# EAGLE design VSCard_v3.1 (EAGLE 8.3.1)
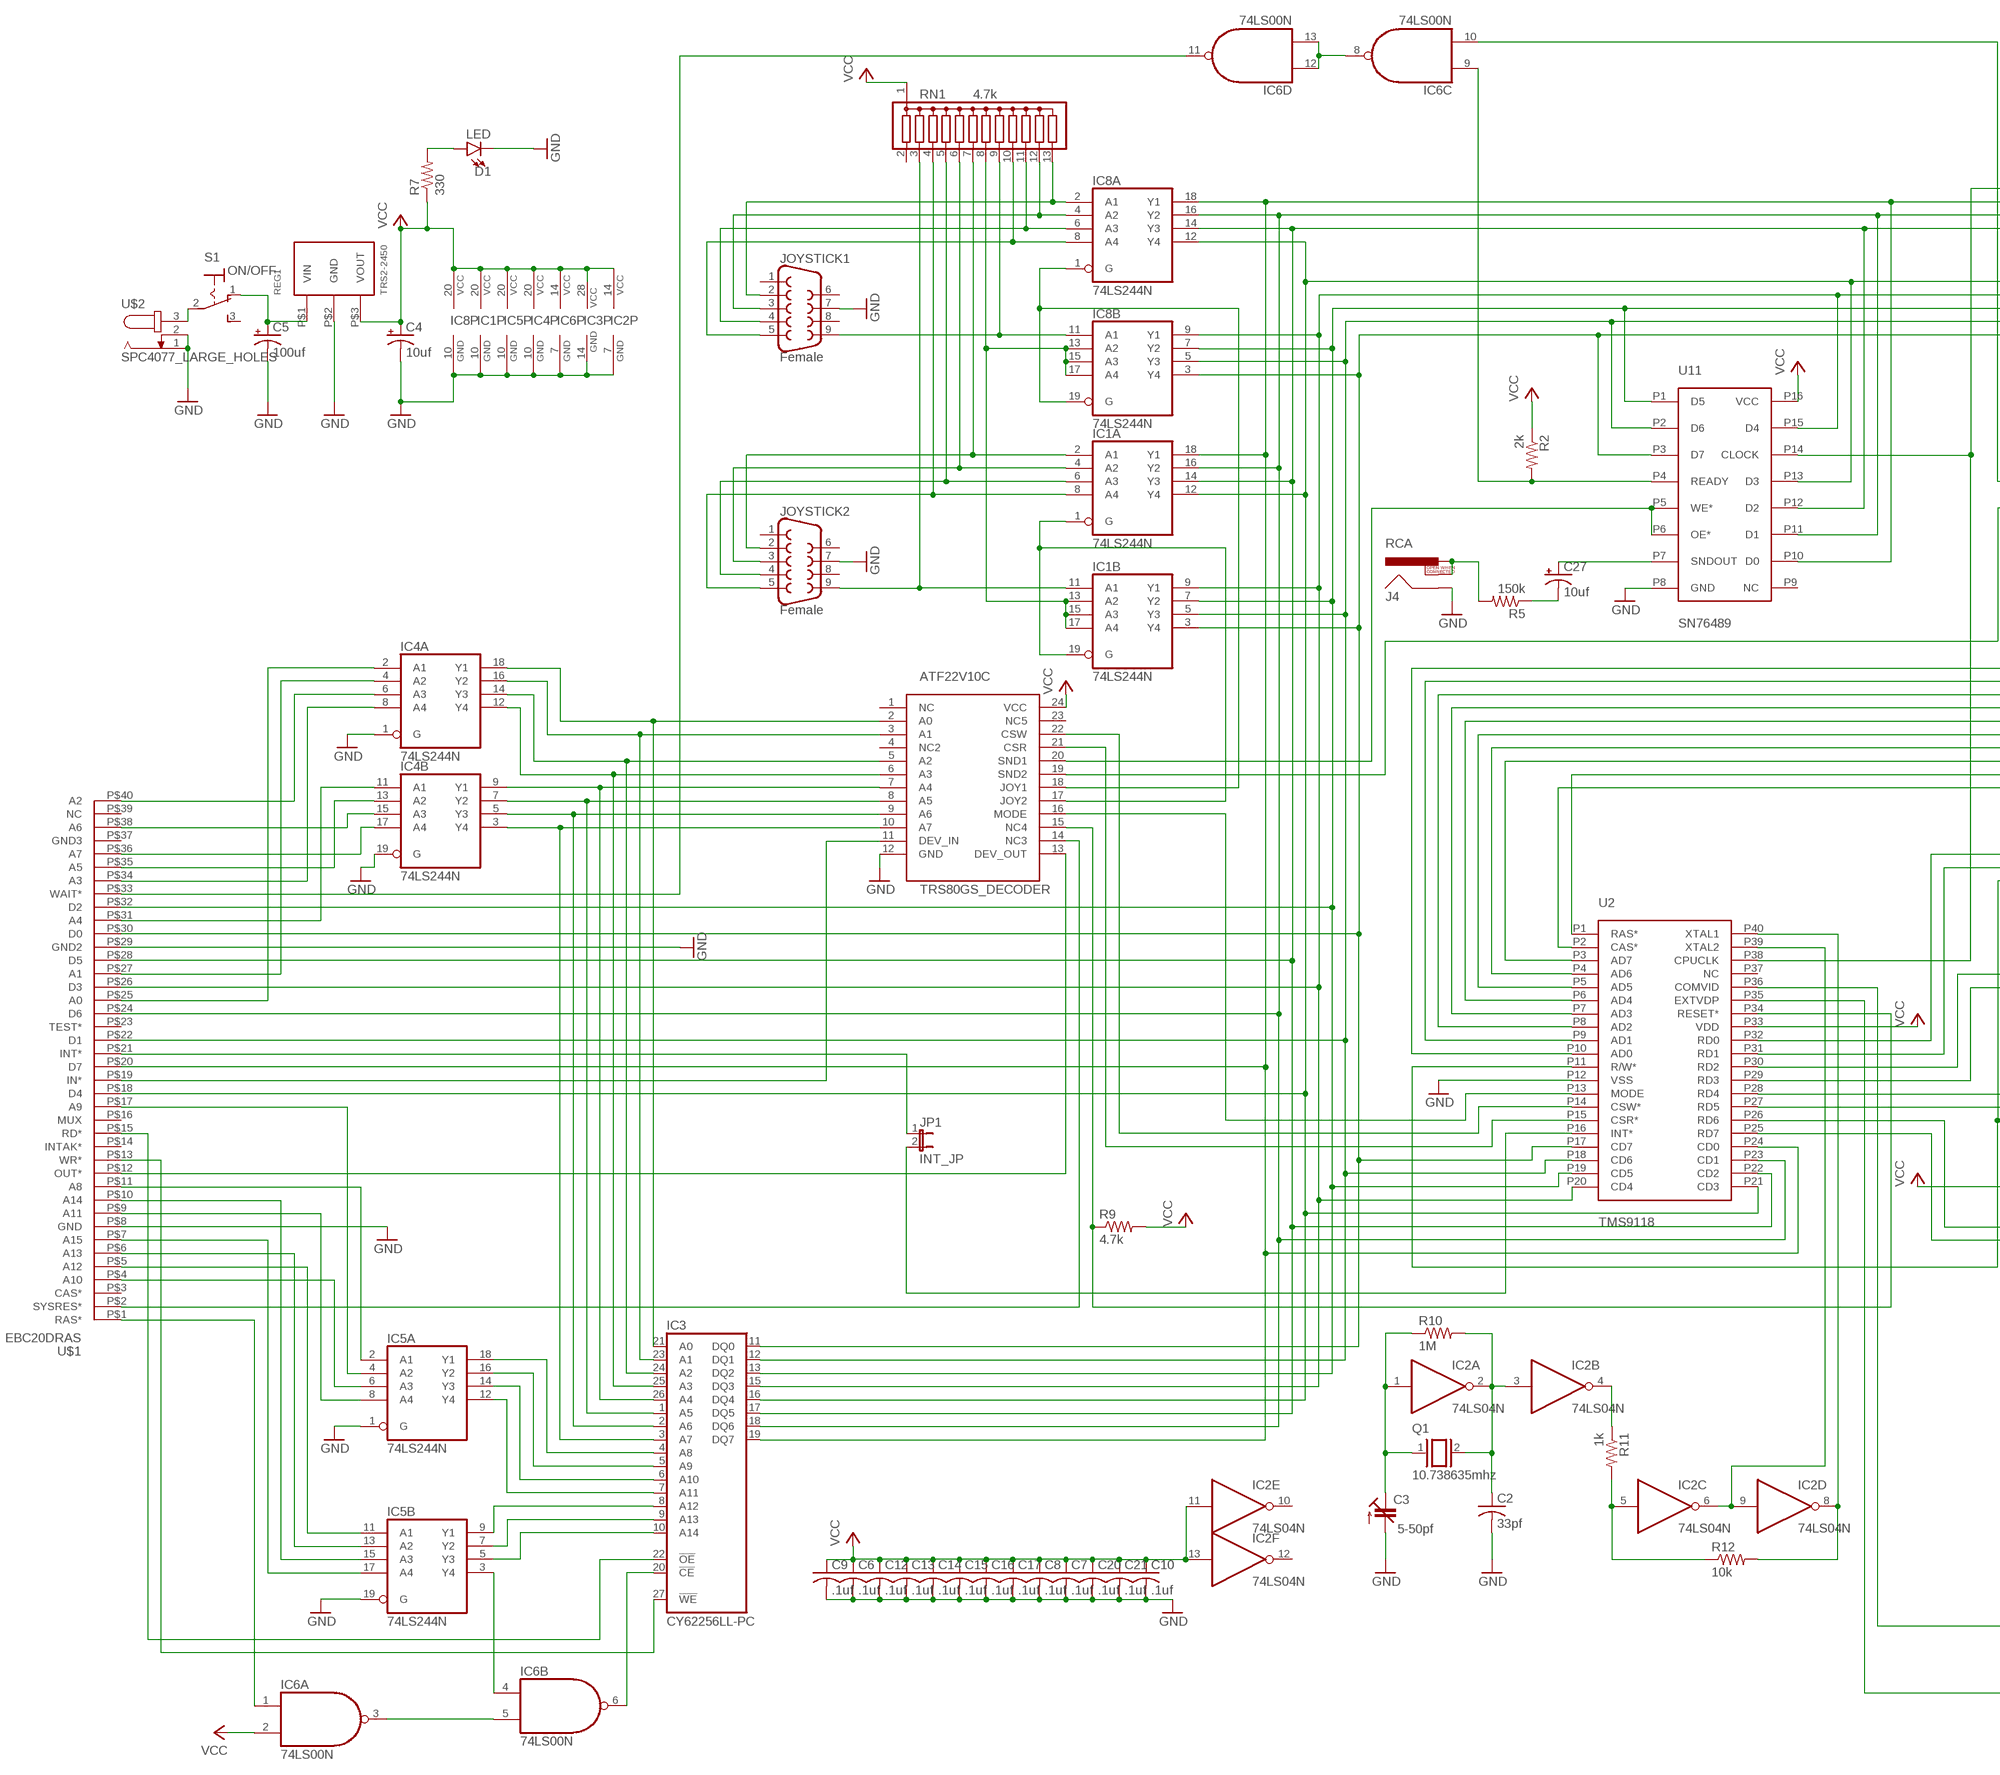
[diagram p0: schematic, sheet 1, part 1 of 2]
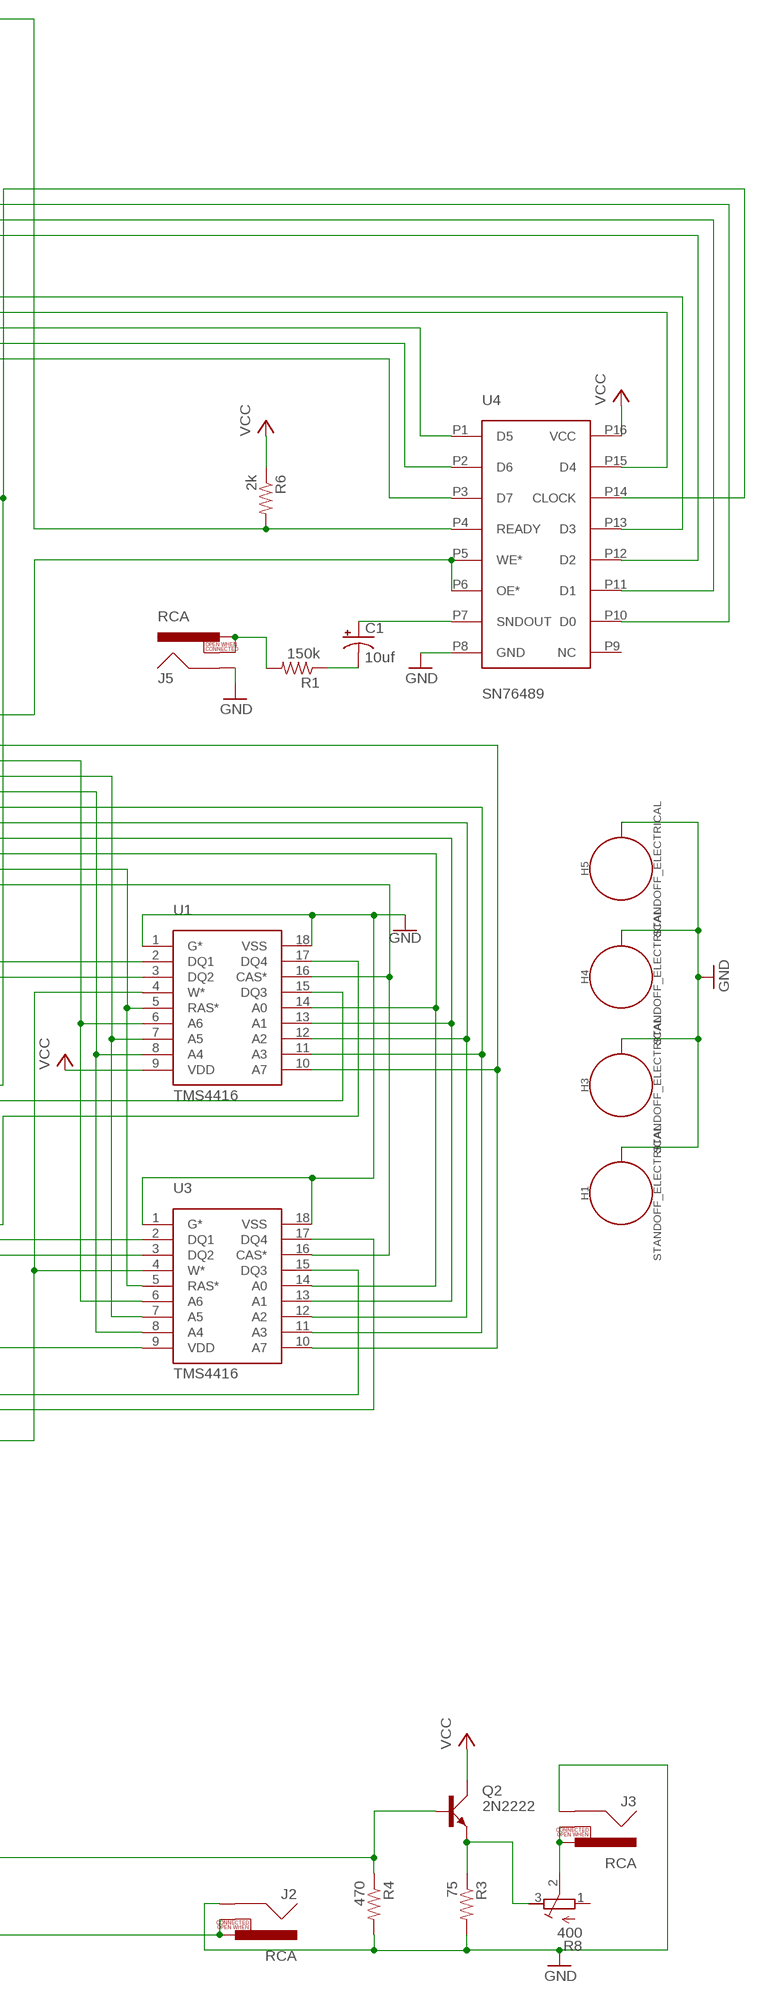
[diagram p1: schematic, sheet 1, part 2 of 2]

## Parts
ATF22V10C  TRS80GS_DECODER  [DIP24SKI]
C1  10uf  CPOL-USE2.5-6  [E2,5-6]
C2  33pf  C-US050-025X075  [C050-025X075]
C3  5-50pf  C-TRIMM3050.504  [CTRIM3050.504]
C4  10uf  CPOL-USE2.5-5  [E2,5-5]
C5  100uf  CPOL-USE3.5-10  [E3,5-10]
C6  .1uf  C-US025-025X050  [C025-025X050]
C7  .1uf  C-US025-025X050  [C025-025X050]
C8  .1uf  C-US025-025X050  [C025-025X050]
C9  .1uf  C-US025-025X050  [C025-025X050]
C10  .1uf  C-US025-025X050  [C025-025X050]
C12  .1uf  C-US025-025X050  [C025-025X050]
C13  .1uf  C-US025-025X050  [C025-025X050]
C14  .1uf  C-US025-025X050  [C025-025X050]
C15  .1uf  C-US025-025X050  [C025-025X050]
C16  .1uf  C-US025-025X050  [C025-025X050]
C17  .1uf  C-US025-025X050  [C025-025X050]
C20  .1uf  C-US025-025X050  [C025-025X050]
C21  .1uf  C-US025-025X050  [C025-025X050]
C27  10uf  CPOL-USE2.5-6  [E2,5-6]
D1  LED  LED3MM  [LED_3MM]
H1  STANDOFF_ELECTRICAL  [STANDOFF-ELECTRICAL]
H3  STANDOFF_ELECTRICAL  [STANDOFF-ELECTRICAL]
H4  STANDOFF_ELECTRICAL  [STANDOFF-ELECTRICAL]
H5  STANDOFF_ELECTRICAL  [STANDOFF-ELECTRICAL]
IC1  74LS244N  [DIL20]
IC2  74LS04N  [DIL14]
IC3  CY62256LL-PC  [DIL28-6]
IC4  74LS244N  [DIL20]
IC5  74LS244N  [DIL20]
IC6  74LS00N  [DIL14]
IC8  74LS244N  [DIL20]
J2  RCA  [RCA]
J3  RCA  [RCA]
J4  RCA  [RCA]
J5  RCA  [RCA]
JOYSTICK1  Female  DB9FEMALE  [DB9]
JOYSTICK2  Female  DB9FEMALE  [DB9]
JP1  INT_JP  JP1E  [JP1]
Q1  10.738635mhz  XTAL/S  [QS]
Q2  2N2222  [TO18A]
R1  150k  R-US_0207/2V  [0207/2V]
R2  2k  R-US_0207/2V  [0207/2V]
R3  75  R-US_0207/2V  [0207/2V]
R4  470  R-US_0207/2V  [0207/2V]
R5  150k  R-US_0207/2V  [0207/2V]
R6  2k  R-US_0207/2V  [0207/2V]
R7  330  R-US_0309/V  [0309V]
R8  400  R-TRIMM64W  [RTRIM64W]
R9  4.7k  R-US_0207/2V  [0207/2V]
R10  1M  R-US_0204/2V  [0204V]
R11  1k  R-US_0204/2V  [0204V]
R12  10k  R-US_0204/2V  [0204V]
REG1  TRS2-2450  [TRACON_REG]
RN1  4.7k  G12R  [SIL13]
S1  ON/OFF  320-916  [320-916]
U1  TMS4416  [DIP18]
U2  TMS9118  [DIP40_MCU]
U3  TMS4416  [DIP18]
U4  SN76489  [DIP16]
U11  SN76489  [DIP16]
U$1  EBC20DRAS  [EBC20DRAS]
U$2  SPC4077_LARGE_HOLES  [SPC4077]

## Nets
A0: IC4.2(A:A1) U$1.P$25(A0)
A1: IC4.4(A:A2) U$1.P$27(A1)
A2: IC4.6(A:A3) U$1.P$40(A2)
A3: IC4.8(A:A4) U$1.P$34(A3)
A4: IC4.11(B:A1) U$1.P$31(A4)
A5: IC4.13(B:A2) U$1.P$35(A5)
A6: IC4.15(B:A3) U$1.P$38(A6)
A7: ATF22V10C.10(A7) IC3.3(A7) IC4.3(B:Y4)
COMVID: Q2.B R4.1 U2.P36(COMVID)
COMVID-OUT: Q2.E R3.1 R8.3(E)
D0: IC1.3(B:Y4) IC3.11(DQ0) IC8.3(B:Y4) U2.P17(CD7) U4.P3(D7) U11.P3(D7) U$1.P$30(D0)
D1: IC1.5(B:Y3) IC3.12(DQ1) IC8.5(B:Y3) U2.P18(CD6) U4.P2(D6) U11.P2(D6) U$1.P$22(D1)
D2: IC1.7(B:Y2) IC3.13(DQ2) IC8.7(B:Y2) U2.P19(CD5) U4.P1(D5) U11.P1(D5) U$1.P$32(D2)
D3: IC1.9(B:Y1) IC3.15(DQ3) IC8.9(B:Y1) U2.P20(CD4) U4.P15(D4) U11.P15(D4) U$1.P$26(D3)
D4: IC1.12(A:Y4) IC3.16(DQ4) IC8.12(A:Y4) U2.P21(CD3) U4.P13(D3) U11.P13(D3) U$1.P$18(D4)
D5: IC1.14(A:Y3) IC3.17(DQ5) IC8.14(A:Y3) U2.P22(CD2) U4.P12(D2) U11.P12(D2) U$1.P$28(D5)
D6: IC1.16(A:Y2) IC3.18(DQ6) IC8.16(A:Y2) U2.P23(CD1) U4.P11(D1) U11.P11(D1) U$1.P$24(D6)
D7: IC1.18(A:Y1) IC3.19(DQ7) IC8.18(A:Y1) U2.P24(CD0) U4.P10(D0) U11.P10(D0) U$1.P$20(D7)
DOWN: IC8.4(A:A2) JOYSTICK1.3 RN1.12
DOWN1: IC1.4(A:A2) JOYSTICK2.3 RN1.6
GND: ATF22V10C.12(GND) C2.2 C3.2(A) C4.- C5.- C6.2 C7.2 C8.2 C9.2 C10.2 C12.2 C13.2 C14.2 C15.2 C16.2 C17.2 C20.2 C21.2 D1.K(C) H1.P1 H3.P1 H4.P1 H5.P1 IC1.10(P:GND) IC2.7(P:GND) IC3.14(GND) IC4.1(A:G) IC4.10(P:GND) IC4.19(B:G) IC5.1(A:G) IC5.10(P:GND) IC5.19(B:G) IC6.7(P:GND) IC8.10(P:GND) J2.SHELL J3.SHELL J4.SHELL J5.SHELL JOYSTICK1.7 JOYSTICK2.7 R3.2 R4.2 REG1.P$2(GND) U1.1(G*) U1.18(VSS) U2.P12(VSS) U3.1(G*) U3.18(VSS) U4.P8(GND) U11.P8(GND) U$1.P$8(GND) U$1.P$29(GND2) U$2.1 U$2.2
IN*: ATF22V10C.11(DEV_IN) U$1.P$19(IN*)
INT*: JP1.1 U$1.P$21(INT*)
JOY1_IN_ENABLE_N: ATF22V10C.18(JOY1) IC8.1(A:G) IC8.19(B:G)
JOY1_IN_ENABLE_N1: ATF22V10C.17(JOY2) IC1.1(A:G) IC1.19(B:G)
LEFT: IC8.6(A:A3) JOYSTICK1.4 RN1.11
LEFT1: IC1.6(A:A3) JOYSTICK2.4 RN1.5
N$1: J4.PIN J4.SWITCH R5.2
N$2: S1.2(P) U$2.3
N$3: JP1.2 U2.P16(INT*)
N$4: J3.PIN J3.SWITCH R8.2(S)
N$5: ATF22V10C.2(A0) IC3.21(A0) IC4.18(A:Y1)
N$6: ATF22V10C.7(A4) IC3.26(A4) IC4.9(B:Y1)
N$7: ATF22V10C.3(A1) IC3.23(A1) IC4.16(A:Y2)
N$8: ATF22V10C.5(A2) IC3.24(A2) IC4.14(A:Y3)
N$9: ATF22V10C.6(A3) IC3.25(A3) IC4.12(A:Y4)
N$10: ATF22V10C.8(A5) IC3.1(A5) IC4.7(B:Y2)
N$11: C3.1(E) IC2.1(A:I) Q1.1 R10.1
N$12: ATF22V10C.9(A6) IC3.2(A6) IC4.5(B:Y3)
N$13: IC5.2(A:A1) U$1.P$11(A8)
N$14: ATF22V10C.22(CSW) U2.P14(CSW*)
N$15: ATF22V10C.21(CSR) U2.P15(CSR*)
N$16: C2.1 IC2.2(A:O) IC2.3(B:I) Q1.2 R10.2
N$17: J2.PIN J2.SWITCH U2.P35(EXTVDP)
N$18: U1.5(RAS*) U2.P1(RAS*) U3.5(RAS*)
N$19: IC5.4(A:A2) U$1.P$17(A9)
N$20: D1.A R7.2
N$21: U1.16(CAS*) U2.P2(CAS*) U3.16(CAS*)
N$22: IC4.17(B:A4) U$1.P$36(A7)
N$23: IC5.6(A:A3) U$1.P$4(A10)
N$24: J5.PIN J5.SWITCH R1.2
N$25: IC5.8(A:A4) U$1.P$9(A11)
N$26: IC5.11(B:A1) U$1.P$5(A12)
N$27: IC5.13(B:A2) U$1.P$6(A13)
N$28: IC5.15(B:A3) U$1.P$10(A14)
N$29: IC5.17(B:A4) U$1.P$7(A15)
N$30: IC3.4(A8) IC5.18(A:Y1)
N$31: IC3.5(A9) IC5.16(A:Y2)
N$32: IC3.6(A10) IC5.14(A:Y3)
N$33: IC3.7(A11) IC5.12(A:Y4)
N$34: IC3.8(A12) IC5.9(B:Y1)
N$35: IC3.9(A13) IC5.7(B:Y2)
N$36: IC3.10(A14) IC5.5(B:Y3)
N$37: IC6.1(A:I0) U$1.P$1(RAS*)
N$38: IC5.3(B:Y4) IC6.4(B:I0)
N$39: IC6.3(A:O) IC6.5(B:I1)
N$40: IC3.20(!CE) IC6.6(B:O)
N$41: IC6.8(C:O) IC6.12(D:I0) IC6.13(D:I1)
N$42: IC3.27(!WE) U$1.P$13(WR*)
N$43: IC3.22(!OE) U$1.P$15(RD*)
N$44: IC2.4(B:O) R11.1
N$45: IC2.5(C:I) R11.2 R12.1
N$46: IC2.6(C:O) IC2.9(D:I) U2.P39(XTAL2)
N$47: IC2.8(D:O) R12.2 U2.P40(XTAL1)
N$64: C27.- R5.1
N$94: C1.- R1.1
N$99: IC1.13(B:A2) IC1.15(B:A3) IC1.17(B:A4) IC8.13(B:A2) IC8.15(B:A3) IC8.17(B:A4) RN1.8
OUT*: ATF22V10C.13(DEV_OUT) U$1.P$12(OUT*)
RIGHT: IC8.8(A:A4) JOYSTICK1.5 RN1.10
RIGHT1: IC1.8(A:A4) JOYSTICK2.5 RN1.4
SN76489-CLOCK: U2.P38(CPUCLK) U4.P14(CLOCK) U11.P14(CLOCK)
SND1_ENABLE_N: ATF22V10C.20(SND1) U11.P5(WE*) U11.P6(OE*)
SND1_READY: IC6.9(C:I0) R2.2 U11.P4(READY)
SND2_ENABLE_N: ATF22V10C.19(SND2) U4.P5(WE*) U4.P6(OE*)
SND2_READY: IC6.10(C:I1) R6.2 U4.P4(READY)
SNDOUT1: C27.+ U11.P7(SNDOUT)
SNDOUT2: C1.+ U4.P7(SNDOUT)
SYSRESET*: ATF22V10C.14(NC3) U$1.P$2(SYSRES*)
TMS9118_RW(*)_TMS4416_W(*): U1.4(W*) U2.P11(R/W*) U3.4(W*)
TMS9918_AD0-TMS4416_A7: U1.10(A7) U2.P10(AD0) U3.10(A7)
TMS9918_AD1-TMS4416_A6: U1.6(A6) U2.P9(AD1) U3.6(A6)
TMS9918_AD2-TMS4416_A5: U1.7(A5) U2.P8(AD2) U3.7(A5)
TMS9918_AD3-TMS4416_A4: U1.8(A4) U2.P7(AD3) U3.8(A4)
TMS9918_AD4-TMS4416_A3: U1.11(A3) U2.P6(AD4) U3.11(A3)
TMS9918_AD5-TMS4416_A2: U1.12(A2) U2.P5(AD5) U3.12(A2)
TMS9918_AD6-TMS4416_A1: U1.13(A1) U2.P4(AD6) U3.13(A1)
TMS9918_AD7-TMS4416_A0: U1.14(A0) U2.P3(AD7) U3.14(A0)
TRIGGER: IC8.11(B:A1) JOYSTICK1.9 RN1.9
TRIGGER1: IC1.11(B:A1) JOYSTICK2.9 RN1.3
UP: IC8.2(A:A1) JOYSTICK1.2 RN1.13
UP1: IC1.2(A:A1) JOYSTICK2.2 RN1.7
VCC: ATF22V10C.24(VCC) C4.+ C6.1 C7.1 C8.1 C9.1 C10.1 C12.1 C13.1 C14.1 C15.1 C16.1 C17.1 C20.1 C21.1 IC1.20(P:VCC) IC2.11(E:I) IC2.13(F:I) IC2.14(P:VCC) IC3.28(VCC) IC4.20(P:VCC) IC5.20(P:VCC) IC6.2(A:I1) IC6.14(P:VCC) IC8.20(P:VCC) Q2.C R2.1 R6.1 R7.1 R9.2 REG1.P$3(VOUT) RN1.1 U1.9(VDD) U2.P33(VDD) U3.9(VDD) U4.P16(VCC) U11.P16(VCC)
VDP-RD0: U1.2(DQ1) U2.P32(RD0)
VDP-RD1: U1.3(DQ2) U2.P31(RD1)
VDP-RD2: U1.15(DQ3) U2.P30(RD2)
VDP-RD3: U1.17(DQ4) U2.P29(RD3)
VDP-RD4: U2.P28(RD4) U3.2(DQ1)
VDP-RD5: U2.P27(RD5) U3.3(DQ2)
VDP-RD6: U2.P26(RD6) U3.15(DQ3)
VDP-RD7: U2.P25(RD7) U3.17(DQ4)
VDP_MODE: ATF22V10C.16(MODE) U2.P13(MODE)
VID_RESET*: ATF22V10C.15(NC4) R9.1 U2.P34(RESET*)
VOLTAGE-IN: C5.+ REG1.P$1(VIN) S1.1(O)
WAIT*: IC6.11(D:O) U$1.P$33(WAIT*)
Unconnected: ATF22V10C.1(NC) ATF22V10C.4(NC2) ATF22V10C.23(NC5) IC2.10(E:O) IC2.12(F:O) JOYSTICK1.1 JOYSTICK1.6 JOYSTICK1.8 JOYSTICK2.1 JOYSTICK2.6 JOYSTICK2.8 R8.1(A) RN1.2 S1.3(S) U2.P37(NC) U4.P9(NC) U11.P9(NC) U$1.P$3(CAS*) U$1.P$14(INTAK*) U$1.P$16(MUX) U$1.P$23(TEST*) U$1.P$37(GND3) U$1.P$39(NC)

## Library data of the parts
ATF22V10C = TMS99:TRS80GS_DECODER
C1 C4 C27 = resistor:CPOL-US: POLARIZED CAPACITOR, American symbol
C2 = rcl:C-US: CAPACITOR, American symbol
C3 = resistor:C-TRIMM: Trimm capacitor
C5 = rcl:CPOL-US: POLARIZED CAPACITOR, American symbol
C6-C10 C12-C17 C20 C21 = resistor:C-US: CAPACITOR, American symbol
D1 = SparkFun-LED:LED: LED (Generic) Standard schematic elements and footprints for 5mm, 3mm, 1206, and 0603 sized LEDs. Generic LEDs with no color specified.; PROD_ID: DIO-08794
H1 H3-H5 = SparkFun-Hardware:STANDOFF_ELECTRICAL: Stand Off Drill holes with an electrical connection. For example, use these to ground your board to a chassis. Example SparkFun Products Screw - Phillips Head (1/4", 4-40, 10 pack) <https://www.sparkfun.com/products/10453> (PRT-10453) Screw - Phillips Head (1/2", 4-40, 10 pack) <https://www.sparkfun.com/products/10452> (PRT-10452) Screw - Phillips Head (3/4", 4-40, 10 pack) <https://www.sparkfun.com/products/10451> (PRT-10451) Screw - Phillips Head (1", 4-40, 10 pack) <https://www.sparkfun.com/products/10450> (PRT-10450)
IC1 IC4 IC5 IC8 = 74xx-us:74*244: Octal BUFFER and LINE DRIVER, 3-state
IC2 = 74xx-us:74*04: Hex INVERTER
IC3 = memory-sram:CY62256LL-?*: 256K (32K x 8) CMOS-Static RAM Source: http://download.cypress.com.edgesuite.net/design_resources/datasheets/contents/cy62256_8.pdf
IC6 = 74xx-us:74*00: Quad 2-input NAND gate
J2-J5 = SparkFun-Connectors:RCA: RCA Jack connector This is a right angle RCA jack connecotr. Commonly used for video or audio. Here is the connector we sell at SparkFun: RCA Jack <https://www.sparkfun.com/products/8631> (PRT-08631) Datasheet <http://www.sparkfun.com/datasheets/Prototyping/Connectors/RCA-Jack.pdf> It is not used on any active designs, however it was used on a couple retired products: RCA Jack Breakout [RETIRED] <https://www.sparkfun.com/products/8826> (PRT-08826) SparkFun On Screen Display Breakout - MAX7456 [RETIRED] <https://www.sparkfun.com/products/9168> (BOB-09168) You may also be interested in a cable: RCA Video Cable - 6' <https://www.sparkfun.com/products/11573> (CAB-11573); PROD_ID: CONN-09081; SF_ID: PRT-08631
JOYSTICK1 JOYSTICK2 = SparkFun-Connectors:DB9: DB9 Connector Standard DB9 (D-Sub 9) serial connector. Can be used for CAN bus as well as RS485 and RS232. Footprint production proven. Here is the female version connector we sell at SparkFun: 9 Pin Female Serial Connector - PCB Mount <https://www.sparkfun.com/products/429> (PRT-00429) This connector has been used on the following SparkFun products: SparkFun RS232 Shifter - SMD <https://www.sparkfun.com/products/449> (PRT-00449) SparkFun RS232 Shifter SMD (No DB9) <https://www.sparkfun.com/products/8780> (PRT-08780); PROD_ID: CONN-08194
JP1 = jumper:JP1E: JUMPER
Q1 = special:XTAL/S: CRYSTAL
Q2 = transistor-small-signal:2N2222: NPN TRANSISTOR
R1-R7 R9 = resistor:R-US_: RESISTOR, American symbol
R8 = resistor:R-TRIMM: Trimm resistor
R10-R12 = rcl:R-US_: RESISTOR, American symbol
REG1 = TMS99:TRS2-2450: 5V TRACO regulator
RN1 = resistor-sil:G12R: SIL RESISTOR; OC_FARNELL: unknown; OC_NEWARK: unknown
S1 = switch:320-916: TOGGLE SWITCH distributor RS Components
U1 U3 = TMS99:TMS4416: TMS4416
U2 = TMS99:TMS9118: TMS9118
U4 U11 = TMS99:SN76489: SN76489 Sound Chip
U$1 = TMS99:EBC20DRAS
U$2 = con-jack:SPC4077_LARGE_HOLES

## Board
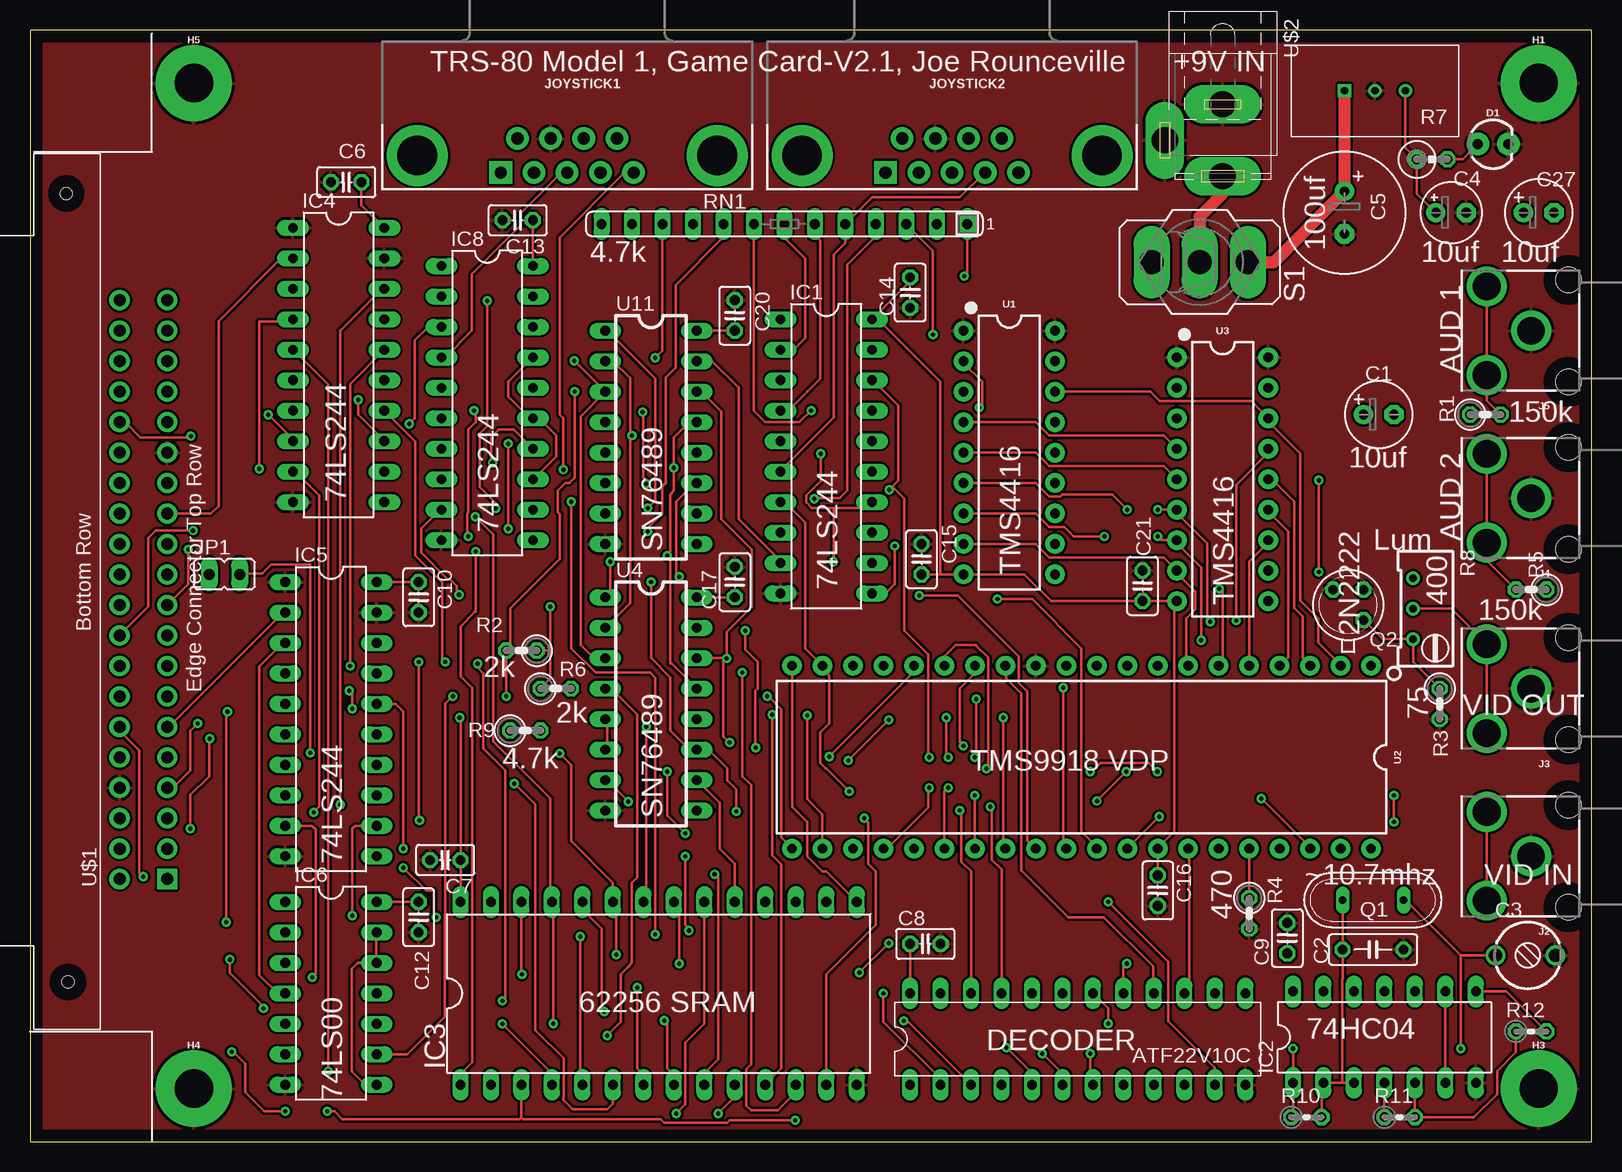
[diagram p2: board, top side]
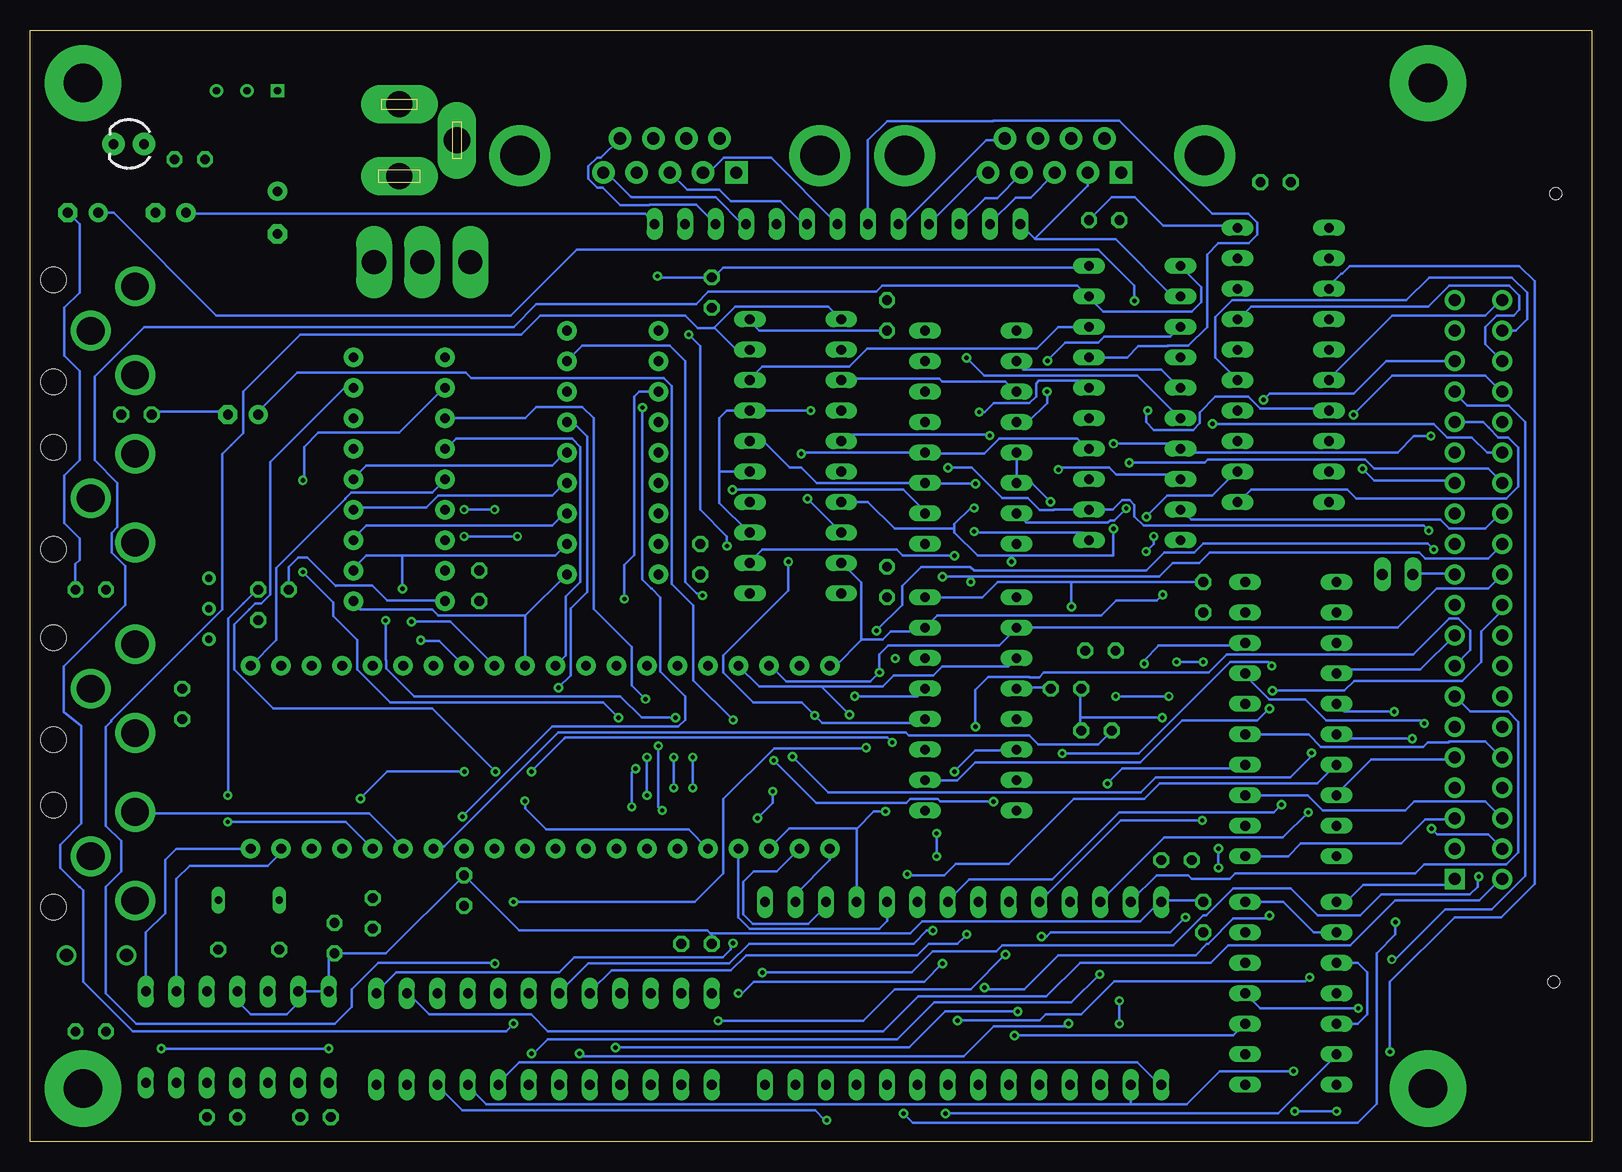
[diagram p3: board, bottom side, seen from below]

Size 130.16 x 92.7 mm. Coordinates in mm from the lower left corner, seen from the top.
Outline: 0,0 130.16,0 130.16,92.7 0,92.7 0,0
Copper layers (1*16): Top 0.035mm / dielectric 1.5mm / Bottom 0.035mm
Design rules "default": minimum track width 0.2mm, minimum drill 0.35mm, track to track 8mil, track to pad 8mil, pad to pad 8mil, via to via 8mil, smd to smd 8mil, copper to edge 40mil, drill to drill 6mil, minimum pad ring 10mil, minimum via ring 8mil, stop-mask expansion 4mil, vias tented up to drill 0mil, thermal gap 10mil

### Footprints (pad centres in the part's own frame; a part is rotated, then mirrored left to right if it is on the bottom)
DIP24SKI = drill 0.813 pad 1.27 long: 1 -11.43,-3.81; 2 -8.89,-3.81; 3 -6.35,-3.81; 4 -3.81,-3.81; 5 -1.27,-3.81; 6 1.27,-3.81; 7 3.81,-3.81; 8 6.35,-3.81; 9 8.89,-3.81; 10 11.43,-3.81; 11 13.97,-3.81; 12 16.51,-3.81; 13 16.51,3.81; 14 13.97,3.81; 15 11.43,3.81; 16 8.89,3.81; 17 6.35,3.81; 18 3.81,3.81; 19 1.27,3.81; 20 -1.27,3.81; 21 -3.81,3.81; 22 -6.35,3.81; 23 -8.89,3.81; 24 -11.43,3.81
E2,5-6 = drill 0.813 pad 1.6: + -1.27,0 | drill 0.813 pad 1.6 octagon: - 1.27,0
C050-025X075 = drill 0.813 octagon: 1 -2.54,0; 2 2.54,0
CTRIM3050.504 = drill 1.1: 1 -2.5,0; 2 2.5,0
E2,5-5 = drill 0.813 pad 1.6: + -1.27,0 | drill 0.813 pad 1.6 octagon: - 1.27,0
E3,5-10 = drill 0.813 pad 1.6: + -1.778,0 | drill 0.813 pad 1.6 octagon: - 1.778,0
C025-025X050 = drill 0.813 octagon: 1 -1.27,0; 2 1.27,0
LED_3MM = drill 0.813 pad 1.88: A -1.27,0; K 1.27,0
STANDOFF-ELECTRICAL = drill 3.2 pad 6.35: P1 0,0
DIL20 = drill 0.813 long: 1 -11.43,-3.81; 2 -8.89,-3.81; 3 -6.35,-3.81; 4 -3.81,-3.81; 5 -1.27,-3.81; 6 1.27,-3.81; 7 3.81,-3.81; 8 6.35,-3.81; 9 8.89,-3.81; 10 11.43,-3.81; 11 11.43,3.81; 12 8.89,3.81; 13 6.35,3.81; 14 3.81,3.81; 15 1.27,3.81; 16 -1.27,3.81; 17 -3.81,3.81; 18 -6.35,3.81; 19 -8.89,3.81; 20 -11.43,3.81
DIL14 = drill 0.813 long: 1 -7.62,-3.81; 2 -5.08,-3.81; 3 -2.54,-3.81; 4 0,-3.81; 5 2.54,-3.81; 6 5.08,-3.81; 7 7.62,-3.81; 8 7.62,3.81; 9 5.08,3.81; 10 2.54,3.81; 11 0,3.81; 12 -2.54,3.81; 13 -5.08,3.81; 14 -7.62,3.81
DIL28-6 = drill 0.813 long: 1 -16.51,-7.62; 2 -13.97,-7.62; 3 -11.43,-7.62; 4 -8.89,-7.62; 5 -6.35,-7.62; 6 -3.81,-7.62; 7 -1.27,-7.62; 8 1.27,-7.62; 9 3.81,-7.62; 10 6.35,-7.62; 11 8.89,-7.62; 12 11.43,-7.62; 13 13.97,-7.62; 14 16.51,-7.62; 15 16.51,7.62; 16 13.97,7.62; 17 11.43,7.62; 18 8.89,7.62; 19 6.35,7.62; 20 3.81,7.62; 21 1.27,7.62; 22 -1.27,7.62; 23 -3.81,7.62; 24 -6.35,7.62; 25 -8.89,7.62; 26 -11.43,7.62; 27 -13.97,7.62; 28 -16.51,7.62
RCA = drill 2.3: PIN 3.7,3.7; SHELL 0,0; SWITCH 3.7,-3.7 | hole 2.1: -3.1,4.25; -3.1,-4.25
DB9 = drill 1.016 pad 1.88 square: 1 -5.54,-1.42 | drill 1.016 pad 1.88: 2 -2.77,-1.42; 3 0,-1.42; 4 2.77,-1.42; 5 5.54,-1.42; 6 -4.15,1.42; 7 -1.38,1.42; 8 1.38,1.42; 9 4.15,1.42 | drill 3.302 pad 5.08: G1 -12.5,0; G2 12.5,0
JP1 = drill 0.914 long: 1 0,-1.27; 2 0,1.27
QS = drill 0.61 long: 1 -2.54,0; 2 2.54,0
TO18A = drill 0.813 octagon: B 1.27,-1.27; C 1.27,1.27; E -1.27,-1.27
0207/2V = drill 0.813 octagon: 1 -1.27,0; 2 1.27,0
0309V = drill 0.813 octagon: 1 -1.27,0; 2 1.27,0
RTRIM64W = drill 0.61: 1 1.27,-2.54; 2 1.27,0; 3 1.27,2.54
0204V = drill 0.813 octagon: 1 -1.27,0; 2 1.27,0
TRACON_REG = drill 0.6 square: P$1 0,0 | drill 0.6: P$2 2.54,0; P$3 5.08,0
SIL13 = drill 0.813 long: 1 -15.24,0; 2 -12.7,0; 3 -10.16,0; 4 -7.62,0; 5 -5.08,0; 6 -2.54,0; 7 0,0; 8 2.54,0; 9 5.08,0; 10 7.62,0; 11 10.16,0; 12 12.7,0; 13 15.24,0
320-916 = drill 2.007 long: 1 0,4.013; 2 0,0; 3 0,-4.013
DIP18 = drill 0.813 pad 1.626: 1 -10.16,-3.81; 2 -7.62,-3.81; 3 -5.08,-3.81; 4 -2.54,-3.81; 5 0,-3.81; 6 2.54,-3.81; 7 5.08,-3.81; 8 7.62,-3.81; 9 10.16,-3.81; 10 10.16,3.81; 11 7.62,3.81; 12 5.08,3.81; 13 2.54,3.81; 14 0,3.81; 15 -2.54,3.81; 16 -5.08,3.81; 17 -7.62,3.81; 18 -10.16,3.81
DIP40_MCU = drill 0.813 pad 1.626: P1 -24.13,-7.62; P2 -21.59,-7.62; P3 -19.05,-7.62; P4 -16.51,-7.62; P5 -13.97,-7.62; P6 -11.43,-7.62; P7 -8.89,-7.62; P8 -6.35,-7.62; P9 -3.81,-7.62; P10 -1.27,-7.62; P11 1.27,-7.62; P12 3.81,-7.62; P13 6.35,-7.62; P14 8.89,-7.62; P15 11.43,-7.62; P16 13.97,-7.62; P17 16.51,-7.62; P18 19.05,-7.62; P19 21.59,-7.62; P20 24.13,-7.62; P21 24.13,7.62; P22 21.59,7.62; P23 19.05,7.62; P24 16.51,7.62; P25 13.97,7.62; P26 11.43,7.62; P27 8.89,7.62; P28 6.35,7.62; P29 3.81,7.62; P30 1.27,7.62; P31 -1.27,7.62; P32 -3.81,7.62; P33 -6.35,7.62; P34 -8.89,7.62; P35 -11.43,7.62; P36 -13.97,7.62; P37 -16.51,7.62; P38 -19.05,7.62; P39 -21.59,7.62; P40 -24.13,7.62
DIP16 = drill 0.813 long: P1 -8.89,-3.81; P2 -6.35,-3.81; P3 -3.81,-3.81; P4 -1.27,-3.81; P5 1.27,-3.81; P6 3.81,-3.81; P7 6.35,-3.81; P8 8.89,-3.81; P9 8.89,3.81; P10 6.35,3.81; P11 3.81,3.81; P12 1.27,3.81; P13 -1.27,3.81; P14 -3.81,3.81; P15 -6.35,3.81; P16 -8.89,3.81
EBC20DRAS = drill 1 pad 1.676 square: P$1 0,0 | drill 1 pad 1.676: P$2 0,3.969; P$3 2.54,0; P$4 2.54,3.969; P$5 5.08,0; P$6 5.08,3.969; P$7 7.62,0; P$8 7.62,3.969; P$9 10.16,0; P$10 10.16,3.969; P$11 12.7,0; P$12 12.7,3.969; P$13 15.24,0; P$14 15.24,3.969; P$15 17.78,0; P$16 17.78,3.969; P$17 20.32,0; P$18 20.32,3.969; P$19 22.86,0; P$20 22.86,3.969; P$21 25.4,0; P$22 25.4,3.969; P$23 27.94,0; P$24 27.94,3.969; P$25 30.48,0; P$26 30.48,3.969; P$27 33.02,0; P$28 33.02,3.969; P$29 35.56,0; P$30 35.56,3.969; P$31 38.1,0; P$32 38.1,3.969; P$33 40.64,0; P$34 40.64,3.969; P$35 43.18,0; P$36 43.18,3.969; P$37 45.72,0; P$38 45.72,3.969; P$39 48.26,0; P$40 48.26,3.969 | hole 1: -8.572,8.255; 57.15,8.414
SPC4077 = drill 2.184 pad 2.184 long: 1 -3,0; 2 0,-4.8; 3 3,0

### Placement (x,y rotation side)
ATF22V10C  84.77,8.57 0 top
C1  112.39,60.64 0 top
C2  111.92,16.03 0 top
C3  124.62,15.56 0 top
C4  118.43,77.47 0 top
C5  109.54,77.47 270 top
C6  26.35,80.01 180 top
C7  34.61,23.49 180 top
C8  74.61,16.51 0 top
C9  104.77,16.99 90 top
C10  32.39,45.4 270 top
C12  32.39,18.73 270 top
C13  40.64,76.83 180 top
C14  73.34,70.8 270 top
C15  74.3,48.58 90 top
C16  93.98,20.95 270 top
C17  58.74,46.67 90 top
C20  58.74,68.9 90 top
C21  92.71,46.36 90 top
C27  125.73,77.47 0 top
D1  121.92,83.18 0 top
H1  125.73,88.27 0 top
H3  125.73,4.45 0 top
H4  13.65,4.45 0 top
H5  13.65,88.27 0 top
IC1  66.36,57.15 270 top
IC2  112.87,8.73 0 top
IC3  52.39,12.38 0 top
IC4  25.72,64.77 270 top
IC5  25.08,35.24 270 top
IC6  25.08,12.38 270 top
IC8  38.1,61.59 270 top
J2  125.09,23.81 180 top
J3  125.09,37.78 180 top
J4  125.09,53.66 180 top
J5  125.09,67.63 180 top
JOYSTICK1  44.77,82.23 0 top
JOYSTICK2  76.83,82.23 0 top
JP1  16.19,47.31 270 top
Q1  111.92,20.16 180 top
Q2  109.85,44.77 90 top
R1  121.28,60.64 0 top
R2  40.96,40.96 180 top
R3  117.47,36.51 270 top
R4  101.6,19.05 270 top
R5  125.09,46.04 180 top
R6  43.82,37.78 0 top
R7  116.84,81.91 0 top
R8  116.52,44.45 180 top
R9  41.27,34.29 0 top
R10  106.36,2.06 0 top
R11  114.14,2.06 0 top
R12  125.09,9.21 0 top
REG1  109.54,87.63 0 top
RN1  62.87,76.52 180 top
S1  97.47,73.34 270 top
U1  81.6,57.47 270 top
U2  87.63,32.07 180 top
U3  99.38,55.25 270 top
U4  51.75,36.51 270 top
U11  51.75,58.74 270 top
U$1  11.43,21.91 90 top
U$2  99.38,83.5 270 top

### Tracks (layer width: path | path; a pad name or v marks a point on that pad's centre or on a via)
A0
  Top 0.2: 21.86,73.61 IC4.2 20.95,73.66 15.72,68.42 15.72,53.02 15.08,52.39 U$1.P$25
A1  (via drill 0.35)
  Top 0.2: v19.11,56.12 19.11,68.36 21.86,68.36 IC4.4
  Bottom 0.2: v19.11,56.12 18.11,55.12 11.62,55.12 U$1.P$27
A2
  Bottom 0.2: IC4.6 21.86,63.62 16.61,68.86 8.87,68.86 7.62,70.11 U$1.P$40
A3  (via drill 0.35)
  Top 0.2: v19.86,60.62 21.86,58.62 IC4.8
  Bottom 0.2: v19.86,60.62 16.61,63.87 8.87,63.87 7.62,62.62 U$1.P$34
A4
  Bottom 0.2: IC4.11 29.36,53.37 28.36,54.37 20.39,54.37 19.64,53.62 7.12,53.62 6.12,54.62 6.12,57.87 6.99,58.74 7.8,58.74 8.6,59.54 8.6,59.56 9.05,60.01 U$1.P$31
A5  (via drill 0.35)
  Top 0.2: v27.36,61.87 27.36,60.62 29.36,58.62 IC4.13
  Bottom 0.2: 11.62,64.86 U$1.P$35 17.14,65.09 19.84,62.39 26.84,62.39 v27.36,61.87
A6
  Bottom 0.2: IC4.15 29.61,63.62 31.36,65.36 31.36,68.77 29.97,70.16 15.46,70.16 13.54,72.07 6.67,72.07 5.4,70.8 5.4,68.58 6.35,67.63 U$1.P$38
A7  (via drill 0.35)
  Top 0.2: v21.27,2.54 21.2,2.62 | v21.27,2.54 20.95,2.54 | v16.83,7.51 v16.82,7.52 16.93,7.52 17.94,6.51 17.94,4.13 19.53,2.54 v21.27,2.54 | v24.76,2.54 25.4,2.54 26.04,1.91 40.8,1.91 40.96,2.06 | 40.96,2.06 IC3.3 | v63.76,1.8 58.31,1.8 58.1,1.59 52.86,1.59 52.55,1.91 41.12,1.91 40.96,2.06
  Bottom 0.2: ATF22V10C.10 96.11,4.62 94.11,2.62 64.72,2.62 63.91,1.8 v63.76,1.8 | IC4.3 21.86,71.36 20.86,72.36 20.82,72.36 20.16,73.02 6.03,73.02 4.76,71.75 4.76,21.52 7.55,18.73 11.43,18.73 16.83,13.34 v16.83,7.53 v16.82,7.52 | v21.27,2.54 v24.76,2.54
COMVID  (via drill 0.35)
  Top 0.2: U2.P36 R4.1 | v113.66,28.89 v113.66,26.67
  Bottom 0.2: Q2.B 111.36,45.87 112.36,44.87 112.39,44.87 113.61,43.64 113.61,28.94 v113.66,28.89 | v113.66,26.67 103.82,26.67 U2.P36
COMVID-OUT
  Top 0.2: R3.1 115.25,40.01 R8.3 112.71,41.91 Q2.E
D0  (via drill 0.35)
  Top 0.2: v61.87,35.62 61.87,23.86 62.62,23.11 62.62,6.12 61.37,4.87 IC3.11 | 47.62,62.87 47.87,62.62 U11.P3 | 47.62,62.87 v45.37,65.11 | 34.12,67.86 IC8.3 33.18,67.94 32.07,66.83 32.07,60.33 v31.61,59.87 | 47.87,40.37 U4.P3 46.99,40.32 45.88,41.43 45.88,60.48 U11.P3 | 47.62,62.87 U11.P3
  Bottom 0.2: U4.P3 48.12,40.12 48.62,39.62 54.12,39.62 54.87,38.87 58.2,38.87 59.1,37.96 64.21,37.96 | U11.P3 48.12,62.62 48.87,63.37 54.12,63.37 54.37,63.62 62.37,63.62 IC1.3 | v45.37,65.11 43.87,66.61 41.12,66.61 40.62,67.11 35.12,67.11 34.37,67.86 IC8.3 | v61.87,35.62 64.21,37.96 | U2.P17 69.39,37.96 64.21,37.96 | U$1.P$30 8.73,57.47 10,58.74 12.06,58.74 13.18,59.85 31.6,59.85 v31.61,59.87
D1  (via drill 0.35)
  Top 0.2: IC3.12 63.82,4.13 62.3,2.62 60.12,2.62 59.7,3.03 59.7,5.82 59.69,5.83 59.69,6.03 60.11,6.45 60.11,29.74 59.37,30.48 59.37,37.86 v59.37,39.14 | U4.P2 50.01,44.93 50.01,58.74 v50.16,58.9 50.01,59.05 50.01,63.66 48.58,65.09 U11.P2
  Bottom 0.2: IC8.5 34.37,62.87 35.87,64.36 47.37,64.36 47.87,64.86 U11.P2 | U2.P18 68.36,39.62 67.11,38.37 60.14,38.37 v59.37,39.14 59.37,40.64 58.65,41.37 49.37,41.37 48.12,42.62 U4.P2 47.87,42.87 16.16,42.87 12.91,46.12 8.62,46.12 7.62,47.12 U$1.P$22 | IC1.5 62,58.96 50.23,58.96 v50.16,58.9
D2  (via drill 0.35)
  Top 0.2: IC3.13 66.36,4.87 66.36,13.97 70.1,17.71 70.11,17.73 70.48,18.1 70.48,22.54 69.85,23.18 69.86,23.19 69.86,26.65 v69.53,26.99 | v48.37,48.37 48.37,45.87 48.12,45.62 U4.P1 | U11.P1 48.12,67.61 52.12,63.62 52.12,53.48 v51.48,52.84 | v39.87,51.12 v39.87,58.2 | IC1.7 62.62,53.12 63.12,53.12 64.61,51.62 64.61,41.12 65.86,39.87 U2.P19 66.11,39.62 66.11,39.37 66.61,38.87 66.61,34.87 65.86,34.12 65.86,31.58 66.33,31.12 66.36,31.12 v68.26,29.21 | v13.41,58.84 13.3,58.74 9.21,58.74 7.94,60.01 U$1.P$32
  Bottom 0.2: v39.87,51.12 39.87,48.87 48.37,48.87 | 48.37,48.87 51.19,48.87 53.11,50.79 53.11,51.08 | v51.48,52.84 51.76,52.84 53.11,51.49 53.11,51.36 | 53.11,51.08 53.11,51.36 | 53.12,51.37 53.11,51.36 | v48.37,48.37 48.37,48.87 | 48.37,48.87 | IC1.7 60.33,53.34 58.1,51.12 53.15,51.12 53.11,51.08 | v68.26,29.21 68.26,28.26 v69.53,26.99 | v39.87,58.2 34.71,58.2 IC8.7 33.96,57.46 20.85,57.46 20.84,57.47 16.19,57.47 14.84,58.83 v13.41,58.84
D3  (via drill 0.35)
  Top 0.2: 55.62,64.86 U11.P15 56.83,65.09 59.05,62.87 59.05,51.93 62.37,48.62 62.37,48.37 IC1.9 | 34.87,46.87 34.83,46.9 | 34.83,46.9 32.62,49.12 32.62,51.12 34.12,52.62 IC8.9 | 34.83,46.9 35.02,46.9 35.56,46.36 35.56,45.8 v35.75,45.62 | U2.P20 63.5,27.94 64.77,26.67 64.77,23.81 66.04,22.54 66.36,22.54 IC3.15
  Bottom 0.2: IC8.9 34.12,52.62 33.37,51.87 12.62,51.87 11.87,51.12 8.87,51.12 7.62,52.37 U$1.P$26 | 60.87,41.87 60.87,46.62 62.37,48.12 IC1.9 | v35.75,45.62 36.25,45.12 39.64,45.12 40.89,43.87 54.56,43.87 U4.P15 55.88,42.55 58.42,42.55 59.1,41.87 60.87,41.87 | 60.87,41.87 60.87,41.85 63.02,39.69 U2.P20
D4  (via drill 0.35)
  Top 0.2: U$1.P$18 7.62,42.37 9.87,44.62 9.87,50.35 10.48,50.96 10.93,50.96 10.96,50.99 13.55,50.99 v13.59,50.95 | U2.P21 63.37,24.61 62.62,25.36 62.62,36.06 61.52,37.16 v61.43,37.16 | U4.P13 53.48,39.87 53.37,39.87 53.37,48.87 v53.12,48.87 53.12,48.99 53.34,49.21 53.34,53.98 53.66,54.29 v53.66,56.2 53.66,58.74 54.93,60.01 U11.P13
  Bottom 0.2: v53.12,48.87 57.41,48.87 57.91,49.37 69.11,49.37 70.11,48.37 IC1.12 | IC8.12 41.87,52.62 | IC8.12 44.81,52.71 44.83,52.68 46.02,52.68 46.99,53.66 49.15,53.66 51.69,56.2 v53.66,56.2 | IC8.12 39.94,52.71 39.15,53.5 38.52,53.5 38.12,53.1 38.12,52.15 37.33,51.37 14,51.37 v13.59,50.95 | U2.P21 63.5,23.49 66.36,20.64 IC3.16 | v61.43,37.16 61.42,37.15 56.2,37.15 U4.P13
D5  (via drill 0.35)
  Top 0.2: 41.87,57.87 IC8.14 40.32,59.37 39.05,59.37 38.42,58.74 38.42,56.75 v38.55,56.62 | v66.95,48.37 66.99,48.41 66.99,52.86 | v65.88,57.37 65.88,55.1 64.68,53.9 64.68,53.33 65.16,52.86 66.99,52.86 | U2.P22 66.04,27.3 64.77,28.57 v64.77,35.56 | 66.99,52.86 69.68,52.86 IC1.14
  Bottom 0.2: IC8.14 42.12,57.87 42.87,58.62 49.37,58.62 50.62,57.37 55.37,57.37 U11.P12 | 55.62,57.37 U11.P12 | U$1.P$28 7.62,55.12 8.62,56.12 18.11,56.12 18.86,56.87 32,56.87 32.25,56.62 v38.55,56.62 | U11.P12 61.48,57.47 61.49,57.46 65.79,57.46 v65.88,57.37 | IC3.17 63.82,19.68 65.32,18.18 69.94,18.18 70.72,18.96 70.72,21.68 69.85,22.54 67.94,22.54 U2.P22 | U4.P12 55.87,34.93 64.14,34.93 v64.77,35.56 65.82,36.62 69.86,36.62 72.36,39.12 72.36,40.56 66.95,45.97 v66.95,48.37 66.99,48.33
D6  (via drill 0.35)
  Top 0.2: v58.87,27.55 58.87,29.36 58.1,30.13 58.1,31.11 56.52,32.7 U4.P11 | 55.62,32.62 U4.P11 | v54.12,47.12 53.87,47.37 53.87,53.37 55.37,54.87 U11.P11 | 55.37,32.87 U4.P11 | U4.P11 54.93,32.7 53.34,34.29 53.34,38.73 51.75,40.32 v51.75,46.67 | v51.37,54.87 51.37,55.16 51.12,55.4 51.12,60.77 v51.05,60.84
  Bottom 0.2: U2.P23 68.36,24.61 66.86,26.11 61.29,26.11 61.28,26.1 | v51.37,54.87 55.37,54.87 U11.P11 55.62,54.87 55.67,54.92 63.61,54.92 63.62,54.93 64.61,54.93 65.88,56.2 66.83,56.2 69.06,58.42 IC1.16 | 42.12,62.87 IC8.16 42.51,63.46 46.08,63.46 46.32,63.22 46.32,62.15 46.88,61.58 49,61.58 49.01,61.59 49.85,61.59 50.61,60.84 v51.05,60.84 | U$1.P$24 7.62,49.62 8.62,48.62 13.87,48.62 14.37,49.12 31.85,49.12 32.7,48.26 34.93,48.26 36.07,47.12 51.74,47.12 | 61.28,26.1 IC3.18 | 61.28,26.1 | v51.75,46.67 51.75,47.1 51.74,47.12 | 51.74,47.12 v54.12,47.12 | v58.87,27.55 59.83,27.55 61.28,26.1
D7  (via drill 0.35)
  Top 0.2: 71.86,54.62 72.36,55.12 72.36,61.37 70.36,63.37 IC1.18 | v26.61,37.62 26.86,37.37 v26.86,36.12 | 71.86,54.62 72.86,53.62 72.86,42.62 74.86,40.62 74.86,32.13 v74.93,32.07 | 71.86,54.62 v71.61,54.37 | U2.P24 71.36,24.36 74.86,27.86 74.86,29.46 v74.93,29.53 | IC3.19 58.74,23.18 57.47,24.45 57.47,28.26 U4.P10
  Bottom 0.2: v71.61,54.37 57.37,54.37 55.62,52.62 U11.P10 | IC1.18 70.11,63.62 69.11,64.61 61.87,64.61 60.37,66.11 46.28,66.11 44.45,67.94 IC8.18 | U2.P24 71.11,24.36 71.12,24.36 71.12,18.73 70.17,17.78 59.37,17.78 58.74,18.41 IC3.19 | v26.61,37.62 20.61,37.62 19.81,38.42 10.79,38.42 9.21,40.01 9.21,42.55 7.46,44.29 U$1.P$20 | v26.86,36.12 27.86,35.12 34.12,35.12 37.62,31.61 51.37,31.61 52.87,30.11 55.37,30.11 U4.P10 | v74.93,32.07 v74.93,29.53
DOWN
  Top 0.2: 34.37,65.61 IC8.4 34.61,65.41 36.83,67.63 36.83,72.33 40.87,76.36 40.87,77.36 44.12,80.61 44.62,80.61 JOYSTICK1.3
  Bottom 0.2: RN1.12 50.12,76.61 48,78.73 46.75,78.73 44.87,80.61 JOYSTICK1.3
DOWN1
  Top 0.2: RN1.6 65.61,76.36 65.61,75.36 65.86,75.11 65.86,63.63 64.78,62.55 64.77,62.55 63.18,60.96 IC1.4
  Bottom 0.2: RN1.6 65.72,76.52 67.63,78.42 71.75,78.42 72.71,79.38 75.4,79.38 JOYSTICK2.3
GND
  pour Top: 0,0.32 130.18,0.32 130.18,92.71 0,92.71
IN*  (via drill 0.35)
  Top 0.2: v89.86,20 94.86,15 94.86,10.07 98.74,6.19 ATF22V10C.11 | v59.62,42.62 59.62,41.03 60.64,40.01 60.64,37.81 60.43,37.6 60.43,32.91 v60.48,32.87 | U$1.P$19 13.18,46.51 v13.18,49.38 v13.19,49.39
  Bottom 0.2: v59.62,42.62 57.47,44.77 57.47,46.36 55.88,47.94 51.8,47.94 51.47,47.62 37.12,47.62 35.62,49.12 33.12,49.12 32.37,49.87 13.66,49.87 v13.19,49.39 | v60.48,32.87 60.55,32.8 68.15,32.8 72.36,28.58 72.36,24.11 72.39,24.09 72.39,22.38 74.77,20 v89.86,20
INT*
  Bottom 0.2: JP1.1 14.87,47.37 11.62,47.37 U$1.P$21
JOY1_IN_ENABLE_N  (via drill 0.35)
  Top 0.2: v89.86,9.87 89.86,11.12 88.61,12.37 ATF22V10C.18
  Bottom 0.2: v89.86,9.87 89.83,9.87 90.49,9.21 121.6,9.21 125.73,13.34 125.73,20.95 126.03,21.25 127.64,22.86 127.64,24.76 125.86,26.54 125.86,34.66 127.36,35.84 127.36,39.65 122.24,44.77 122.24,48.03 123.36,49.15 123.36,50.77 122.87,51.25 122.87,54.93 124.78,56.83 124.78,63.82 120.65,67.94 89.85,67.94 87.95,69.85 74.63,69.85 73.61,70.86 59.62,70.86 59.12,71.36 42.87,71.36 42.12,70.61 IC8.19 41.87,70.36 40.72,69.21 33.34,69.21 32.54,70.01 32.54,71.28 IC8.1
JOY1_IN_ENABLE_N1  (via drill 0.35)
  Top 0.2: 91.41,14.88 v91.41,14.87 91.12,14.58 ATF22V10C.17
  Bottom 0.2: 73.11,67.86 71.36,66.11 70.36,66.11 IC1.19 | 73.11,67.86 71.36,69.61 63.62,69.61 62.62,68.61 IC1.1 | 73.11,67.86 74.53,67.86 75.56,68.9 87.63,68.9 89.22,67.31 107.62,67.31 112.36,62.56 112.36,59.09 113.36,58.09 114.11,57.34 114.11,44.37 123.36,35.12 123.36,35.07 123.82,34.61 123.82,26.35 122.55,25.08 122.55,22.54 123.82,21.27 123.82,12.38 121.28,9.84 104.77,9.84 103.35,11.27 103.35,12.7 101.12,14.92 91.47,14.92 v91.41,14.87
LEFT  (via drill 0.35)
  Top 0.2: RN1.11 52.71,65.95 v52.12,65.36
  Bottom 0.2: v52.12,65.36 50.62,63.87 37.87,63.87 34.37,60.37 IC8.6 | JOYSTICK1.4 47.62,80.61 49.55,78.68 50.55,78.68 52.62,76.61 RN1.11
LEFT1
  Top 0.2: 62.62,56.12 IC1.6 62.58,55.91 62.58,55.98 66.99,60.4 66.99,73.98 67.94,74.93 RN1.5 | 67.86,76.36 RN1.5 | JOYSTICK2.4 79.54,80.81 77.47,78.74 70.17,78.74 RN1.5
N$1
  Top 0.2: J4.SWITCH J4.PIN 121.39,48.47 R5.2
N$2
  Top 1.016: U$2.3 99.38,79.06 97.47,77.15 S1.2
N$3  (via drill 0.35)
  Top 0.2: v23.36,32.43 23.36,48.12 20.11,48.12 19.36,47.37 17.61,47.37 JP1.2 | v66.61,32.12 73.86,39.37 73.86,39.62 U2.P16
  Bottom 0.2: v66.61,32.12 63.62,29.11 37.58,29.11 36.33,30.36 25.11,30.36 23.36,32.12 v23.36,32.43
N$4
  Top 0.2: J3.PIN J3.SWITCH 118.43,44.45 R8.2
N$5  (via drill 0.35)
  Top 0.2: v54.12,14.87 54.12,19.61 53.87,19.86 IC3.21 | 75.86,4.87 ATF22V10C.2 75.88,5.26 71.12,10.02 v71.12,12.38 | v25.86,28.11 25.86,67.61 29.36,71.11 IC4.18
  Bottom 0.2: IC3.21 53.62,20.11 51.87,21.86 44.97,21.86 39.37,27.46 32.76,27.46 32.74,27.48 26.5,27.48 v25.86,28.11 | v71.12,12.38 70.8,12.38 69.85,13.34 55.65,13.34 v54.12,14.87
N$6  (via drill 0.35)
  Top 0.2: IC4.9 22.11,55.87 24.11,53.87 24.11,27.96 v23.64,27.48 | v88.36,7.37 88.36,4.87 ATF22V10C.7 | 40.87,18.86 40.87,19.86 IC3.26 40.96,14.02 v41,13.98
  Bottom 0.2: IC3.26 40.87,20.11 35.62,25.36 25.75,25.36 v23.64,27.48 | v41,13.98 43.37,11.62 54.82,11.62 57.89,8.55 87,8.55 88.19,7.37 v88.36,7.37
N$7  (via drill 0.35)
  Top 0.2: v48.87,15.62 48.87,19.61 48.62,19.86 IC3.23 48.58,21.59 45.09,25.08 45.09,31.43 v44.13,32.39 | IC4.16 26.67,63.18 v26.67,39.69 | v72.82,10.1 73.09,10.1 ATF22V10C.3
  Bottom 0.2: v26.67,39.69 26.99,40.01 27.82,40.01 27.83,40.02 30.14,40.02 37.77,32.39 v44.13,32.39 | v72.82,10.1 60.71,10.1 58.1,12.7 51.78,12.7 v48.87,15.62
N$8  (via drill 0.35)
  Top 0.2: v81.36,7.87 83.36,5.87 83.36,4.87 ATF22V10C.5 | 46.12,19.86 IC3.24 46.04,19.37 47.62,17.78 47.62,11.09 v47.84,10.87 | IC4.14 29.61,60.87 32.12,58.37 32.12,48.87 34.37,46.62 34.37,40.25 v34.61,40.01 | v32.39,40.01 32.39,26.87 v32.46,26.8
  Bottom 0.2: v47.84,10.87 53.87,10.87 56.87,7.87 v81.36,7.87 | 45.87,20.11 IC3.24 39.24,26.8 v32.46,26.8 | v32.39,40.01 v34.61,40.01
N$9  (via drill 0.35)
  Top 0.2: v43.62,9.87 43.62,19.86 IC3.25 43.37,20.11 43.37,28.61 38.62,33.37 38.62,50.62 v37.12,52.12 | v84.36,7.37 85.86,5.87 85.86,4.87 ATF22V10C.6
  Bottom 0.2: v43.62,9.87 43.87,9.62 49.83,9.62 52.33,7.12 84.11,7.12 v84.36,7.37 | v37.12,52.12 35.37,53.87 31.61,53.87 29.61,55.87 IC4.12
N$10  (via drill 0.35)
  Top 0.2: IC3.1 36.12,4.87 36.12,5.87 36.87,6.62 36.84,6.64 36.84,37.83 35.88,38.79 35.88,42.98 37.07,44.18 37.12,44.18 37.15,44.21 v37.15,49.21 | v37,60.97 37.15,60.83 37.15,60.01 36.51,59.37 36.51,52.48 36.43,52.4 36.43,50.88 36.51,50.8 v36.51,50.48
  Bottom 0.2: IC3.1 36.12,4.87 37.87,6.62 89.36,6.62 91.11,4.87 ATF22V10C.8 | IC4.7 22.11,61.12 27.61,61.12 28.61,62.12 31.36,62.12 32.67,60.81 32.67,59.93 33.23,59.36 36.5,59.36 37.15,60.01 37.15,60.83 v37,60.97 | v36.51,50.48 36.51,49.85 v37.15,49.21
N$11  (via drill 0.35)
  Top 0.2: R10.1 105.25,2.22 IC2.1 v105.25,7.78 | C3.1 119.26,15.56 | 119.26,15.56 119.22,15.52 v119.22,7.78 | 119.26,15.56 119.22,15.56 114.93,19.84 114.78,19.84 Q1.1
  Bottom 0.2: v105.25,7.78 v119.22,7.78
N$12  (via drill 0.35)
  Top 0.2: v24.86,5.9 24.86,63.12 22.11,65.86 IC4.5
  Bottom 0.2: 38.39,3.12 92.11,3.12 93.61,4.62 ATF22V10C.9 | 38.39,3.12 33.78,3.12 31.03,5.87 24.86,5.87 v24.86,5.9 | IC3.2 38.42,3.14 38.39,3.12
N$13
  Top 0.2: IC5.2 21.11,44.12 11.62,34.62 U$1.P$11
N$14  (via drill 0.35)
  Top 0.2: U2.P14 78.74,39.05 77.47,37.78 77.47,33.34 v77.79,33.02 | ATF22V10C.22 78.42,22.55 77.62,23.35 77.62,27.47 v77.47,27.62
  Bottom 0.2: v77.79,33.02 77.79,27.94 v77.47,27.62
N$15  (via drill 0.35)
  Top 0.2: v79.69,31.11 79.86,31.29 79.86,40.37 78.87,41.36 78.86,41.37 78.8,41.43 77.15,41.43 76.2,40.48 U2.P15 | ATF22V10C.21 80.96,22.71 80.16,23.51 80.16,27.79 v80.01,27.94
  Bottom 0.2: v79.69,31.11 80.01,30.8 v80.01,27.94
N$16
  Top 0.2: R10.2 107.63,4.76 IC2.2 109.4,4.92 | 109.4,4.92 IC2.3 | Q1.2 C2.1 109.38,13.61 109.37,13.6 109.37,4.96 109.4,4.92
N$17
  Top 0.2: J2.SWITCH J2.PIN
  Bottom 0.2: U2.P35 99.11,24.61 101.86,27.36 121.36,27.36 J2.SWITCH
N$18
  Top 0.2: U1.5 83.83,57.47 84.94,56.35 94.46,56.35 U3.5
  Bottom 0.2: U3.5 95.61,55.12 96.61,54.12 103.36,54.12 103.86,53.62 103.86,53.61 109.61,47.86 109.61,41.83 U2.P1
N$19
  Bottom 0.2: U$1.P$17 14.29,39.37 20.95,39.37 IC5.4
N$20
  Top 0.2: 118.43,81.91 R7.2 119.38,81.91 D1.A
N$21
  Top 0.2: U1.16 93.35,62.55 94.15,61.75 101.76,61.75 U3.16 103.36,60.12 103.36,59.87 105.86,57.37 105.86,45.12 107.36,43.62 107.36,41.62 109.11,39.87 U2.P2
N$22
  Bottom 0.2: IC4.17 29.36,68.61 28.36,69.61 13.62,69.61 11.87,71.36 6.87,71.36 6.03,70.53 6.03,69.37 6.51,68.9 7.94,68.9 8.89,67.94 8.89,66.52 U$1.P$36
N$23  (via drill 0.35)
  Top 0.2: v13.37,26.11 13.37,28.92 14.92,30.48 14.92,33.56 v14.98,33.62
  Bottom 0.2: v14.98,33.62 20.86,33.62 21.11,33.87 IC5.6 | v13.37,26.11 12.87,25.61 8.62,25.61 7.62,24.61 U$1.P$4
N$24
  Top 0.2: J5.SWITCH J5.PIN 121.39,61.8 R1.2
N$25
  Bottom 0.2: IC5.8 21.11,29.11 18.36,31.86 11.62,31.86 U$1.P$9
N$26
  Bottom 0.2: U$1.P$5 11.62,26.86 13.87,26.86 15.87,24.86 24.24,24.86 25.29,23.81 IC5.11
N$27
  Bottom 0.2: IC5.13 28.86,28.86 23.68,28.86 22.44,27.62 15.56,27.62 14.81,28.36 8.87,28.36 7.62,27.11 U$1.P$6
N$28
  Bottom 0.2: U$1.P$10 7.62,32.12 8.87,33.37 11.87,33.37 11.91,33.32 13.68,33.32 14.06,32.93 22.57,32.93 23.61,33.97 IC5.15
N$29  (via drill 0.35)
  Top 0.2: 11.62,29.36 U$1.P$7 11.91,29.53 13.34,30.96 13.34,34.24 v13.98,34.89
  Bottom 0.2: IC5.17 28.86,38.87 26.86,36.87 23.86,36.87 22.11,35.12 14.21,35.12 v13.98,34.89
N$30  (via drill 0.35)
  Top 0.2: v39.37,11.75 39.62,11.99 39.62,30.98 37.78,32.81 37.78,39.05 37.3,39.54 v37.3,39.87 | 39.62,9.6 v39.37,9.84 43.5,5.71 IC3.4
  Bottom 0.2: 36.08,41.37 29.11,41.37 IC5.18 | 36.08,41.37 36.12,41.37 | v39.37,11.75 v39.37,9.84 | v37.3,39.87 37.3,40.15 36.08,41.37
N$31  (via drill 0.35)
  Top 0.2: v45.87,17.11 45.87,4.87 IC3.5 | v33.87,18.73 33.66,18.94 33.66,20.95 33.02,20.95 v31.11,22.86 | IC5.16 30.48,36.51 31.11,35.88 v31.11,24.45
  Bottom 0.2: v31.11,24.45 v31.11,22.86 | v45.87,17.11 45.43,17.11 45.09,17.46 35.13,17.46 v33.87,18.73
N$32  (via drill 0.35)
  Top 0.2: v40.37,29.86 42.12,28.11 42.12,9.32 44.46,6.97 44.46,3.7 44.45,3.69 44.45,3.49 45.24,2.7 48.1,2.7 48.58,3.17 IC3.6
  Bottom 0.2: v40.37,29.86 39.12,31.11 29.36,31.11 29.11,31.36 IC5.14
N$33  (via drill 0.35)
  Top 0.2: v26.86,18.86 26.86,26.11 27.1,26.35 IC5.12 | v50.62,12.87 50.62,6.12 51.12,5.62 51.12,4.87 IC3.7
  Bottom 0.2: v26.86,18.86 27.11,18.61 29.87,18.61 31.99,16.5 32.08,16.5 33.02,15.56 44.45,15.56 47.31,12.7 50.45,12.7 v50.62,12.87
N$34  (via drill 0.35)
  Top 0.2: v52.87,10.12 53.12,9.87 53.12,6.12 53.62,5.62 53.62,4.87 IC3.8 | 22.32,26.35 IC5.9 | 22.32,26.35 22.54,26.35 | v23.52,13.71 23.81,14 23.81,26.04 23.49,26.35 22.32,26.35
  Bottom 0.2: v52.87,10.12 46.01,10.12 45.51,10.62 42.57,10.62 39.82,13.37 23.87,13.37 v23.52,13.71
N$35  (via drill 0.35)
  Top 0.2: IC3.9 56.37,4.87 56.37,5.87 57.37,6.87 57.37,22 v57.05,22.32
  Bottom 0.2: IC5.7 21.36,31.36 22.86,29.86 36.02,29.86 37.31,28.57 43.18,28.57 48.58,23.18 53.02,23.18 53.98,22.22 56.86,22.22 57,22.36 v57.05,22.32
N$36  (via drill 0.35)
  Top 0.2: v57.37,2.37 58.62,3.62 58.62,4.62 IC3.10 | v16.36,18.32 16.36,35.77 v16.46,35.87
  Bottom 0.2: v16.46,35.87 20.61,35.87 21.11,36.37 IC5.5 | v16.36,18.32 16.36,17.29 17.94,15.72 17.94,3.17 19.53,1.59 56.59,1.59 v57.37,2.37
N$37
  Bottom 0.2: IC6.1 20.48,20 19.05,21.43 11.91,21.43 U$1.P$1
N$38
  Top 0.2: IC5.3 21.11,41.62 19.11,39.62 19.11,13.9 20.64,12.38 IC6.4
N$39
  Bottom 0.2: IC6.3 19.53,14.92 18.73,14.13 18.73,10.64 19.53,9.84 IC6.5
N$40  (via drill 0.35)
  Top 0.2: 56.37,19.86 IC3.20 56.2,9.84 54.62,8.27 54.62,3.12 v53.87,2.37
  Bottom 0.2: v53.87,2.37 26.11,2.37 21.36,7.12 IC6.6
N$41
  Top 0.2: IC6.13 28.86,17.36 28.86,15.12 IC6.12 27.3,14.92 26.83,14.45 26.83,5.87 | IC6.8 27.94,4.76 26.85,5.85 | 26.85,5.85 26.83,5.87 | 26.83,5.87 26.85,5.85
N$42
  Bottom 0.2: IC3.27 38.37,20.11 36.26,22.22 33.66,22.22 33.34,21.91 30.16,21.91 29.7,22.36 14.7,22.36 13.95,23.11 7.12,23.11 6.12,24.11 6.12,35.01 6.99,35.88 10.1,35.88 10.12,35.87 11.37,37.12 U$1.P$13
N$43  (via drill 0.35)
  Top 0.2: v51.37,34.62 51.37,20.11 IC3.22
  Bottom 0.2: v51.37,34.62 51.37,37.68 50.29,38.75 46.88,38.75 46.87,38.73 46.04,38.73 45.66,39.12 31.93,39.12 30.43,40.62 14.87,40.62 11.87,43.62 11.12,43.62 10.12,42.62 10.12,41 U$1.P$15
N$44
  Top 0.2: R11.1 IC2.4
N$45
  Top 0.2: IC2.5 R11.2 120.33,2.06 122.25,3.98 122.25,5.89 123.82,7.46 R12.1
N$46
  Top 0.2: IC2.6 IC2.9
  Bottom 0.2: IC2.9 117.95,21.91 116.84,23.01 110.34,23.01 109.22,24.14 U2.P39
N$47
  Top 0.2: IC2.8 123.03,12.54 R12.2
  Bottom 0.2: U2.P40 117.95,24.45 118.9,23.49 118.9,19.05 120.49,17.46 IC2.8
N$64
  Bottom 0.2: R5.1 126.36,48.17 126.03,48.51 126.03,50.3 127.32,51.59 127.32,55.56 126.03,56.85 126.03,64.27 127.32,65.56 127.32,69.53 126.03,70.82 126.03,70.98 126.03,71.12 126.03,76.5 C27.-
N$94
  Bottom 0.2: R1.1 119.86,60.87 113.86,60.87 C1.-
N$99  (via drill 0.35)
  Top 0.2: IC8.13 42.12,55.37 43.87,57.12 43.87,58.87 42.62,60.12 42.12,60.12 IC8.15 41.87,60.12 39.87,62.12 39.87,63.37 41.87,65.36 IC8.17 | RN1.8 60.33,60.96 61.29,60 64.12,60 v65.09,60.96
  Bottom 0.2: 70.28,50.84 70.36,50.87 | 70.28,50.84 IC1.13 | 70.36,60.87 IC1.17 | IC1.17 v65.09,60.96 | 70.28,50.84 72.71,53.27 72.71,55.92 | RN1.8 60.33,83.5 58.74,85.09 49.89,85.09 49.87,85.11 39.37,85.11 31.61,77.36 28.61,77.36 27.86,76.61 27.86,75.64 28.57,74.93 31.11,74.93 32.07,73.98 32.07,67.94 33.64,66.37 35.35,66.37 35.36,66.36 37.78,66.36 38.73,65.41 IC8.17 | IC1.17 72.07,60.96 72.71,60.33 72.71,55.92 | IC1.15 72.67,55.88 72.71,55.92
OUT*  (via drill 0.35)
  Top 0.2: U$1.P$12 7.62,34.37 7.62,34.12 9.12,32.62 9.12,22.43 v9.43,22.11 | v69.12,14.12 v71.57,16.57
  Bottom 0.2: ATF22V10C.13 101.11,12.62 99.61,14.12 86.07,14.12 84.82,15.37 72.42,15.37 71.75,16.03 71.75,16.38 v71.57,16.57 | v69.12,14.12 56.69,14.12 54.93,15.88 49.62,15.88 49.62,15.87 49.12,16.36 34.87,16.36 32.37,18.86 32.12,18.86 29.86,21.11 25.09,21.11 22.84,18.86 19.32,18.86 17.57,20.61 10.18,20.61 9.53,21.27 9.53,22.02 v9.43,22.11
RIGHT  (via drill 0.35)
  Top 0.2: JOYSTICK1.5 50.12,80.61 49.37,80.61 44.13,75.38 44.13,60.64 44.45,60.33 v44.45,56.04
  Bottom 0.2: IC8.8 34.37,55.37 34.62,55.62 39.62,55.62 40.22,56.21 42.86,56.21 42.97,56.21 44.28,56.21 v44.45,56.04 | RN1.10 55.12,76.61 51.12,80.61 50.37,80.61 JOYSTICK1.5
RIGHT1  (via drill 0.35)
  Top 0.2: RN1.4 70.36,76.36 70.36,75.36 68.11,73.11 68.11,54.3 67.47,53.66 65.41,53.66 v65.36,53.62
  Bottom 0.2: v65.36,53.62 62.62,50.87 IC1.8 | JOYSTICK2.5 82.08,80.81 80.07,78.8 80.01,78.74 73.02,78.74 70.8,76.52 RN1.4
SN76489-CLOCK  (via drill 0.35)
  Top 0.2: v102.61,28.61 106.61,24.61 U2.P38 | v58.05,40.3 | v58.05,40.3 57.79,40.04 57.79,33.81 v58.3,33.3 | 58.1,40.35 v58.05,40.3 | U4.P14 58.02,40.32 v58.05,40.3 | v88.36,30.86 88.49,30.86 89.22,31.59 93.23,31.59 v93.95,30.86 | v58.05,40.3 58.05,42.49 60.17,44.61 60.17,49.37 57.62,51.92 57.62,60.87 55.93,62.55 U11.P14
  Bottom 0.2: v102.61,28.61 100.36,30.86 v93.95,30.86 | v88.36,30.86 85.61,33.62 85.62,33.62 85.53,33.7 58.7,33.7 v58.3,33.3
SND1_ENABLE_N  (via drill 0.35)
  Top 0.2: v52.09,17.3 52.12,17.32 52.12,38.69 51.69,39.12 47.13,39.12 45.12,41.13 v45.12,53.37
  Bottom 0.2: v45.12,53.37 46.62,54.87 47.87,54.87 | ATF22V10C.20 83.36,12.62 81.69,14.29 71.75,14.29 70.48,15.56 56.2,15.56 55.25,16.51 52.86,16.51 52.23,17.14 52.25,17.14 v52.09,17.3 | 47.87,54.87 U11.P6 | U11.P5 47.94,54.94 47.87,54.87
SND1_READY  (via drill 0.35)
  Top 0.2: v39.69,37.15 R2.2 40.01,41.27 40.01,44.45 44.13,48.58 44.13,52.36 43.97,52.52 43.97,54.29 44.62,54.93 44.96,54.93 45.4,55.38 v45.4,62.55 | IC6.9 31.43,7.3 34.55,10.42 34.55,18.99 34.61,19.05 34.61,36.55 35.2,37.15 v35.24,37.15
  Bottom 0.2: v35.24,37.15 v39.69,37.15 | U11.P4 46.99,60.01 45.4,61.59 v45.4,62.55
SND2_ENABLE_N  (via drill 0.35)
  Top 0.2: U4.P6 48.12,32.87 48.12,35.12 U4.P5 | v54.61,25.72 53.12,27.21 v53.12,30.86 | v54.91,17.61 54.91,17.79 54.61,18.1 54.61,18.93 54.62,18.94 54.62,21.06 54.61,21.07 v54.61,23.81
  Bottom 0.2: v53.12,30.86 51.37,32.62 48.12,32.62 U4.P6 | ATF22V10C.19 85.86,12.62 83.61,14.87 71.86,14.87 70.22,16.51 56.52,16.51 55.41,17.61 v54.91,17.61 | v54.61,25.72 v54.61,23.81
SND2_READY  (via drill 0.35)
  Top 0.2: U4.P4 48.12,37.62 48.62,37.62 50.62,35.62 50.62,22.04 50.15,21.58 50.15,18.94 50.16,18.93 50.16,14.92 49.85,14.61 49.77,14.53 49.21,13.97 49.21,10.04 49.23,10.02 48.12,8.9 v48.12,8.87
  Bottom 0.2: v48.12,8.87 29.86,8.87 29.11,9.62 IC6.10 | R6.2 45.12,37.87 47.87,37.87 U4.P4
SNDOUT1  (via drill 0.35)
  Top 0.2: v38.8,52.82 38.8,53.28 37.47,54.61 37.47,59.05 38.1,59.69 38.1,70.1 v38.12,70.11
  Bottom 0.2: U11.P7 47.87,52.37 47.12,51.62 40.33,51.62 40.15,51.8 39.82,51.8 v38.8,52.82 | 124.36,77.36 C27.+ 123.19,77.47 114.62,68.9 90.08,68.9 84.61,74.36 41.12,74.36 38.12,71.36 v38.12,70.11
SNDOUT2  (via drill 0.35)
  Top 0.2: v49.87,28.36 48.12,30.11 U4.P7 | v71.57,35.18 v68.18,31.8
  Bottom 0.2: v71.57,35.18 74.86,38.48 74.86,44.7 76.67,46.51 76.67,63.01 77.32,63.66 93.39,63.66 93.84,64.11 107.86,64.11 111.11,60.87 C1.+ | v49.87,28.36 54.28,28.36 54.5,28.59 56.82,28.59 57.15,28.26 64.64,28.26 v68.18,31.8
SYSRESET*
  Bottom 0.2: ATF22V10C.14 98.61,12.37 96.86,10.62 88.4,10.62 86.99,9.21 59.05,9.21 56.15,12.12 45.45,12.12 42.65,14.92 31.75,14.92 30.31,16.36 20.11,16.36 16.36,20.11 9.37,20.11 7.62,21.86 U$1.P$2
TMS9118_RW(*)_TMS4416_W(*)
  Top 0.2: U1.4 83.83,60.01 84.94,58.89 94.46,58.89 U3.4
  Bottom 0.2: 85.49,45.49 84.29,46.69 84.29,50.31 84.3,50.32 84.3,51.92 84.29,51.93 84.29,55.39 84.3,55.4 84.3,57 84.29,57.01 84.29,57.93 84.98,58.62 94.61,58.62 95.36,57.87 U3.4 | 85.49,45.49 85.5,45.48 | 85.49,45.49 85.49,41.44 85.49,40.55 U2.P11
TMS9918_AD0-TMS4416_A7
  Bottom 0.2: 88.86,43.87 88.86,39.87 U2.P10 | 88.86,43.87 96.11,43.87 96.61,44.37 102.61,44.37 103.11,44.87 U3.10 | U1.10 85.42,47.31 88.86,43.87
TMS9918_AD1-TMS4416_A6  (via drill 0.35)
  Top 0.2: U1.6 83.83,54.93 84.94,53.81 85.87,53.81 86.03,53.98 90.17,53.98 v91.44,52.71 | v98.36,43.37 98.11,43.62 98.11,49.87 95.61,52.37 95.61,52.62 U3.6 v93.98,52.71
  Bottom 0.2: v98.36,43.37 95.11,43.37 91.61,39.87 U2.P9 | v91.44,52.71 v93.98,52.71
TMS9918_AD2-TMS4416_A5  (via drill 0.35)
  Top 0.2: U1.7 83.83,52.39 84.94,51.27 86.21,51.27 86.99,50.48 v89.53,50.48 | v93.98,50.48 94.3,50.16 U3.7 95.61,50.12 95.61,49.87 97.61,47.87 97.61,41.84 v97.59,41.82
  Bottom 0.2: v89.53,50.48 v93.98,50.48 | U2.P8 96.04,41.75 97.52,41.75 v97.59,41.82
TMS9918_AD3-TMS4416_A4
  Top 0.2: U1.8 83.83,49.85 84.94,48.73 94.46,48.73 U3.8 95.61,47.62 95.61,47.37 97.11,45.87 97.11,44.37 96.36,43.62 96.36,39.87 U2.P7
TMS9918_AD4-TMS4416_A3  (via drill 0.35)
  Top 0.2: 99.14,46.12 v99.11,46.12 99.38,45.85 99.38,40.32 99.06,40.01 U2.P6
  Bottom 0.2: 99.11,48.87 102.11,48.87 103.11,47.87 U3.11 | 99.11,48.87 86.36,48.87 85.61,49.62 U1.11 | 99.11,48.87 v99.11,46.12
TMS9918_AD5-TMS4416_A2
  Top 0.2: U2.P5 101.61,39.87 101.61,48.37 103.11,49.87 103.11,50.12 U3.12
  Bottom 0.2: U1.12 85.61,52.37 86.61,51.37 102.11,51.37 103.11,50.37 U3.12
TMS9918_AD6-TMS4416_A1
  Top 0.2: U2.P4 104.36,39.87 104.86,40.37 104.86,50.87 103.36,52.37 103.36,52.62 U3.13
  Bottom 0.2: U1.13 85.61,54.87 86.61,53.87 96.11,53.87 97.11,52.87 103.11,52.87 U3.13
TMS9918_AD7-TMS4416_A0
  Top 0.2: U3.14 103.36,55.37 105.36,53.37 105.36,44.5 106.05,43.82 106.05,40.32 U2.P3
  Bottom 0.2: U1.14 85.61,57.37 86.61,56.37 102.11,56.37 103.11,55.37 U3.14
TRIGGER  (via drill 0.35)
  Top 0.2: v51.48,50.89 51.48,51.16 52.71,52.39 52.71,54.66 52.98,54.93 52.98,63.71 53.82,64.55 53.82,71.44 57.79,75.41 RN1.9
  Bottom 0.2: IC8.11 41.79,50.16 42.44,50.81 51.4,50.81 v51.48,50.89 | RN1.9 57.47,76.52 50.48,83.5 49.07,83.5 JOYSTICK1.9
TRIGGER1  (via drill 0.35)
  Top 0.2: v75.25,67.31 75.25,74.3 RN1.3 | v72.07,49.69 72.07,46.51 71.44,45.88 70.33,45.88 IC1.11
  Bottom 0.2: v72.07,49.69 72.07,50.48 74.3,52.71 74.3,66.36 v75.25,67.31 | JOYSTICK2.9 82.58,82.06 82.89,82.06 83.62,81.33 83.62,80.3 82.89,79.57 82.43,79.57 80.96,78.1 78.54,78.1 78.5,78.14 74.65,78.14 RN1.3
UP
  Bottom 0.2: IC8.2 34.93,70.48 39.69,75.25 46.36,75.25 46.42,75.31 | 46.42,75.31 RN1.13 | JOYSTICK1.2 42,79.73 46.42,75.31
UP1
  Top 0.2: RN1.7 62.87,75.36 64.61,73.61 64.61,68.11 64.61,66.99 63.66,66.04 IC1.2
  Bottom 0.2: JOYSTICK2.2 73.6,80.81 72.36,82.06 68.4,82.06 RN1.7
VCC  (via drill 0.35)
  Top 0.2: C15.1 75.86,47.31 | 75.86,47.31 U1.9 82.87,47.31 85.09,45.09 C21.1 U3.9 95.36,44.87 95.36,25.86 94.11,24.61 U2.P33 C16.1 | C17.1 U4.P16 | IC3.28 C7.1 | C12.1 IC6.14 | C6.1 27.62,78.1 IC4.20 | C20.1 U11.P16 | C14.1 73.34,71.75 IC1.20 70.36,68.86 75.86,63.37 75.86,47.31 | REG1.P$3 114.62,82.87 R7.1 115.57,79.06 C4.+ | ATF22V10C.24 C8.1 | IC5.20 C10.1 | 43.37,41.07 v43.37,44.62 | 43.37,41.07 43.37,38.62 42.62,37.87 R6.1 | 35.87,23.61 C7.1 | R2.1 43.25,40.96 43.37,41.07 | C7.1 35.88,35.29 v35.8,35.37 | C13.1 IC8.20 | RN1.1 78.1,72.43 v77.86,72.19
  Bottom 0.2: 42.62,35.39 42.62,37.62 R6.1 | 42.62,35.39 42.62,34.37 R9.2 | C12.1 32.62,20.11 35.87,20.11 IC3.28 36.12,19.86 37.62,18.36 55.8,18.36 56.8,17.36 73.34,17.36 | 73.34,17.36 73.48,17.36 73.73,17.61 89.36,17.61 93.86,22.11 C16.1 100.49,15.72 C9.1 105.25,15.24 IC2.14 IC2.13 107.79,11.59 108.74,10.64 111.76,10.64 112.87,11.75 IC2.11 | RN1.1 78.11,76.61 78.86,77.36 117.11,77.36 C4.+ | U3.9 95.61,45.12 100.38,45.12 101.63,46.37 104.67,46.37 104.68,46.36 107.06,48.74 107.79,48.74 108.58,47.94 Q2.C | C20.1 58.87,67.61 69.36,67.61 70.11,68.36 IC1.20 | IC4.20 29.61,76.36 35.73,76.36 38.1,78.74 40.01,78.74 C13.1 | C14.1 73.11,72.11 72.36,72.86 42.12,72.86 IC8.20 | 73.36,72.11 C14.1 | v35.8,35.37 42.59,35.37 42.62,35.39 | C8.1 73.34,17.36 | 73.34,17.36 | 43.39,46.67 C10.1 | 43.39,46.67 49.53,46.67 50.8,45.4 U4.P16 | IC6.2 23.18,17.46 25.72,20 IC6.14 | v43.37,44.62 43.37,46.65 43.39,46.67 | C14.1 77.75,72.07 v77.86,72.19
VDP-RD0  (via drill 0.35)
  Top 0.2: v94.11,27.11 91.61,24.61 U2.P32 | v79.11,61.23 79.36,61.48 79.36,63.37 77.79,64.94 U1.2
  Bottom 0.2: v94.11,27.11 86.61,34.62 76.11,34.62 75.56,35.16 75.56,37.15 77.62,39.21 77.62,40.15 77.63,40.16 77.63,45.4 78.34,46.12 78.36,46.12 79.11,46.87 v79.11,61.23
VDP-RD1  (via drill 0.35)
  Top 0.2: U2.P31 88.86,24.61 87.61,25.86 87.61,41.13 83.5,45.24 80.63,45.24 v80.62,45.25
  Bottom 0.2: U1.3 79.4,62.55 79.8,62.15 79.8,48.93 80.62,48.11 v80.62,45.25
VDP-RD2  (via drill 0.35)
  Top 0.2: v86.11,37.87 86.11,24.61 U2.P30
  Bottom 0.2: v86.11,37.87 85.09,38.89 85.09,41.27 85.09,41.28 85.09,44.45 83.71,45.83 83.71,58.78 84.94,60.01 U1.15
VDP-RD3  (via drill 0.35)
  Top 0.2: U2.P29 83.61,24.61 83.11,25.11 83.11,37.54 82.4,38.25 82.4,40.15 82.39,40.16 82.39,40.48 77.32,45.55 v74.11,45.55
  Bottom 0.2: U1.17 85.36,65.11 84.11,66.36 76.84,66.36 75.56,65.09 75.56,46.67 74.61,45.72 74.29,45.72 v74.11,45.55
VDP-RD4  (via drill 0.35)
  Top 0.2: v81.11,35.37 81.11,24.61 U2.P28 | v107.41,47.52 v107.41,55.16
  Bottom 0.2: v81.11,35.37 82.36,36.62 100.11,36.62 102.86,39.37 102.86,41.83 104.86,43.83 104.86,44.98 v107.41,47.52 | U3.2 95.61,62.87 99.36,59.12 106.14,59.12 107.31,57.94 107.31,55.25 v107.41,55.16
VDP-RD5  (via drill 0.35)
  Top 0.2: v78.86,36.91 78.86,32.19 v78.74,32.07 | U2.P27 v78.74,28.89
  Bottom 0.2: v78.74,32.07 v78.74,28.89 | v78.86,36.91 80.01,38.06 80.01,41.26 83.18,44.44 83.18,60.33 84.14,61.28 87.95,61.28 88.9,60.33 U3.3
VDP-RD6  (via drill 0.35)
  Top 0.2: U3.15 103.11,57.62 103.11,57.37 100.52,54.77 v100.52,43.46 | v76.36,35.37 76.36,32.22 v76.52,32.07 | U2.P26 76.2,29.21 v76.52,29.53
  Bottom 0.2: v76.52,32.07 v76.52,29.53 | v76.36,35.37 79.18,35.37 80.96,37.15 98.08,37.15 98.11,37.12 100.48,39.48 100.48,40.15 100.52,40.19 v100.52,43.46
VDP-RD7  (via drill 0.35)
  Top 0.2: v91.36,30.86 v88.91,28.41
  Bottom 0.2: v91.36,30.86 96.61,36.12 109.86,36.12 113.11,39.37 113.11,43.15 111.9,44.37 111.86,44.37 111.36,44.87 110.86,44.87 110.11,45.62 110.11,56.67 103.92,62.87 U3.17 103.36,62.87 | 73.86,24.61 U2.P25 75.25,26.04 87.15,26.04 88.9,27.78 88.9,28.4 v88.91,28.41
VDP_MODE
  Top 0.2: ATF22V10C.16 93.61,12.62 93.61,14.62 89.5,18.73 86.52,18.73 82.61,22.64 82.61,37.37 81.36,38.62 81.36,39.62 U2.P13
VID_RESET*
  Top 0.2: ATF22V10C.15 96.36,12.62 96.61,12.87 96.61,24.36 U2.P34
  Bottom 0.2: R9.1 40.12,34.12 41.12,33.12 46.12,33.12 46.87,33.87 56.91,33.87 57.16,34.12 86.11,34.12 95.61,24.61 96.36,24.61 U2.P34
VOLTAGE-IN
  Top 1.016: S1.1 103.63,73.34 C5.+ REG1.P$1
WAIT*  (via drill 0.35)
  Top 0.2: v16.66,15.2 16.66,14.09 19.46,11.3 v19.46,11.14
  Bottom 0.2: 28.86,12.37 IC6.11 27.65,11.14 v19.46,11.14 | U$1.P$33 11.37,62.37 10.37,61.37 6.91,61.37 5.56,60.01 5.56,22.17 8.36,19.37 12.22,19.37 16.39,15.2 v16.66,15.2

### Text on the board
tNames: TRS-80 Model 1, Game Card-V2.1, Joe Rounceville | +9V IN | 100uf | 4.7k | 10uf | 10uf | AUD 1 | 150k | AUD 2 | 10uf | 74LS244 | Lum | 74LS244 | SN76489 | TMS4416 | 74LS244 | TMS4416 | 400 | 150k | 2N2222 | 2k | 2k | 75 | VID OUT | TMS9918 VDP | 4.7k | SN76489 | 74LS244 | VID IN | ~10.7mhz | 470 | 62256 SRAM | 74HC04 | DECODER | 74LS00
tValues: VIN | VCC